# Altium project OpenPLCv0.2.0.PrjPcb (part 1 of 3)
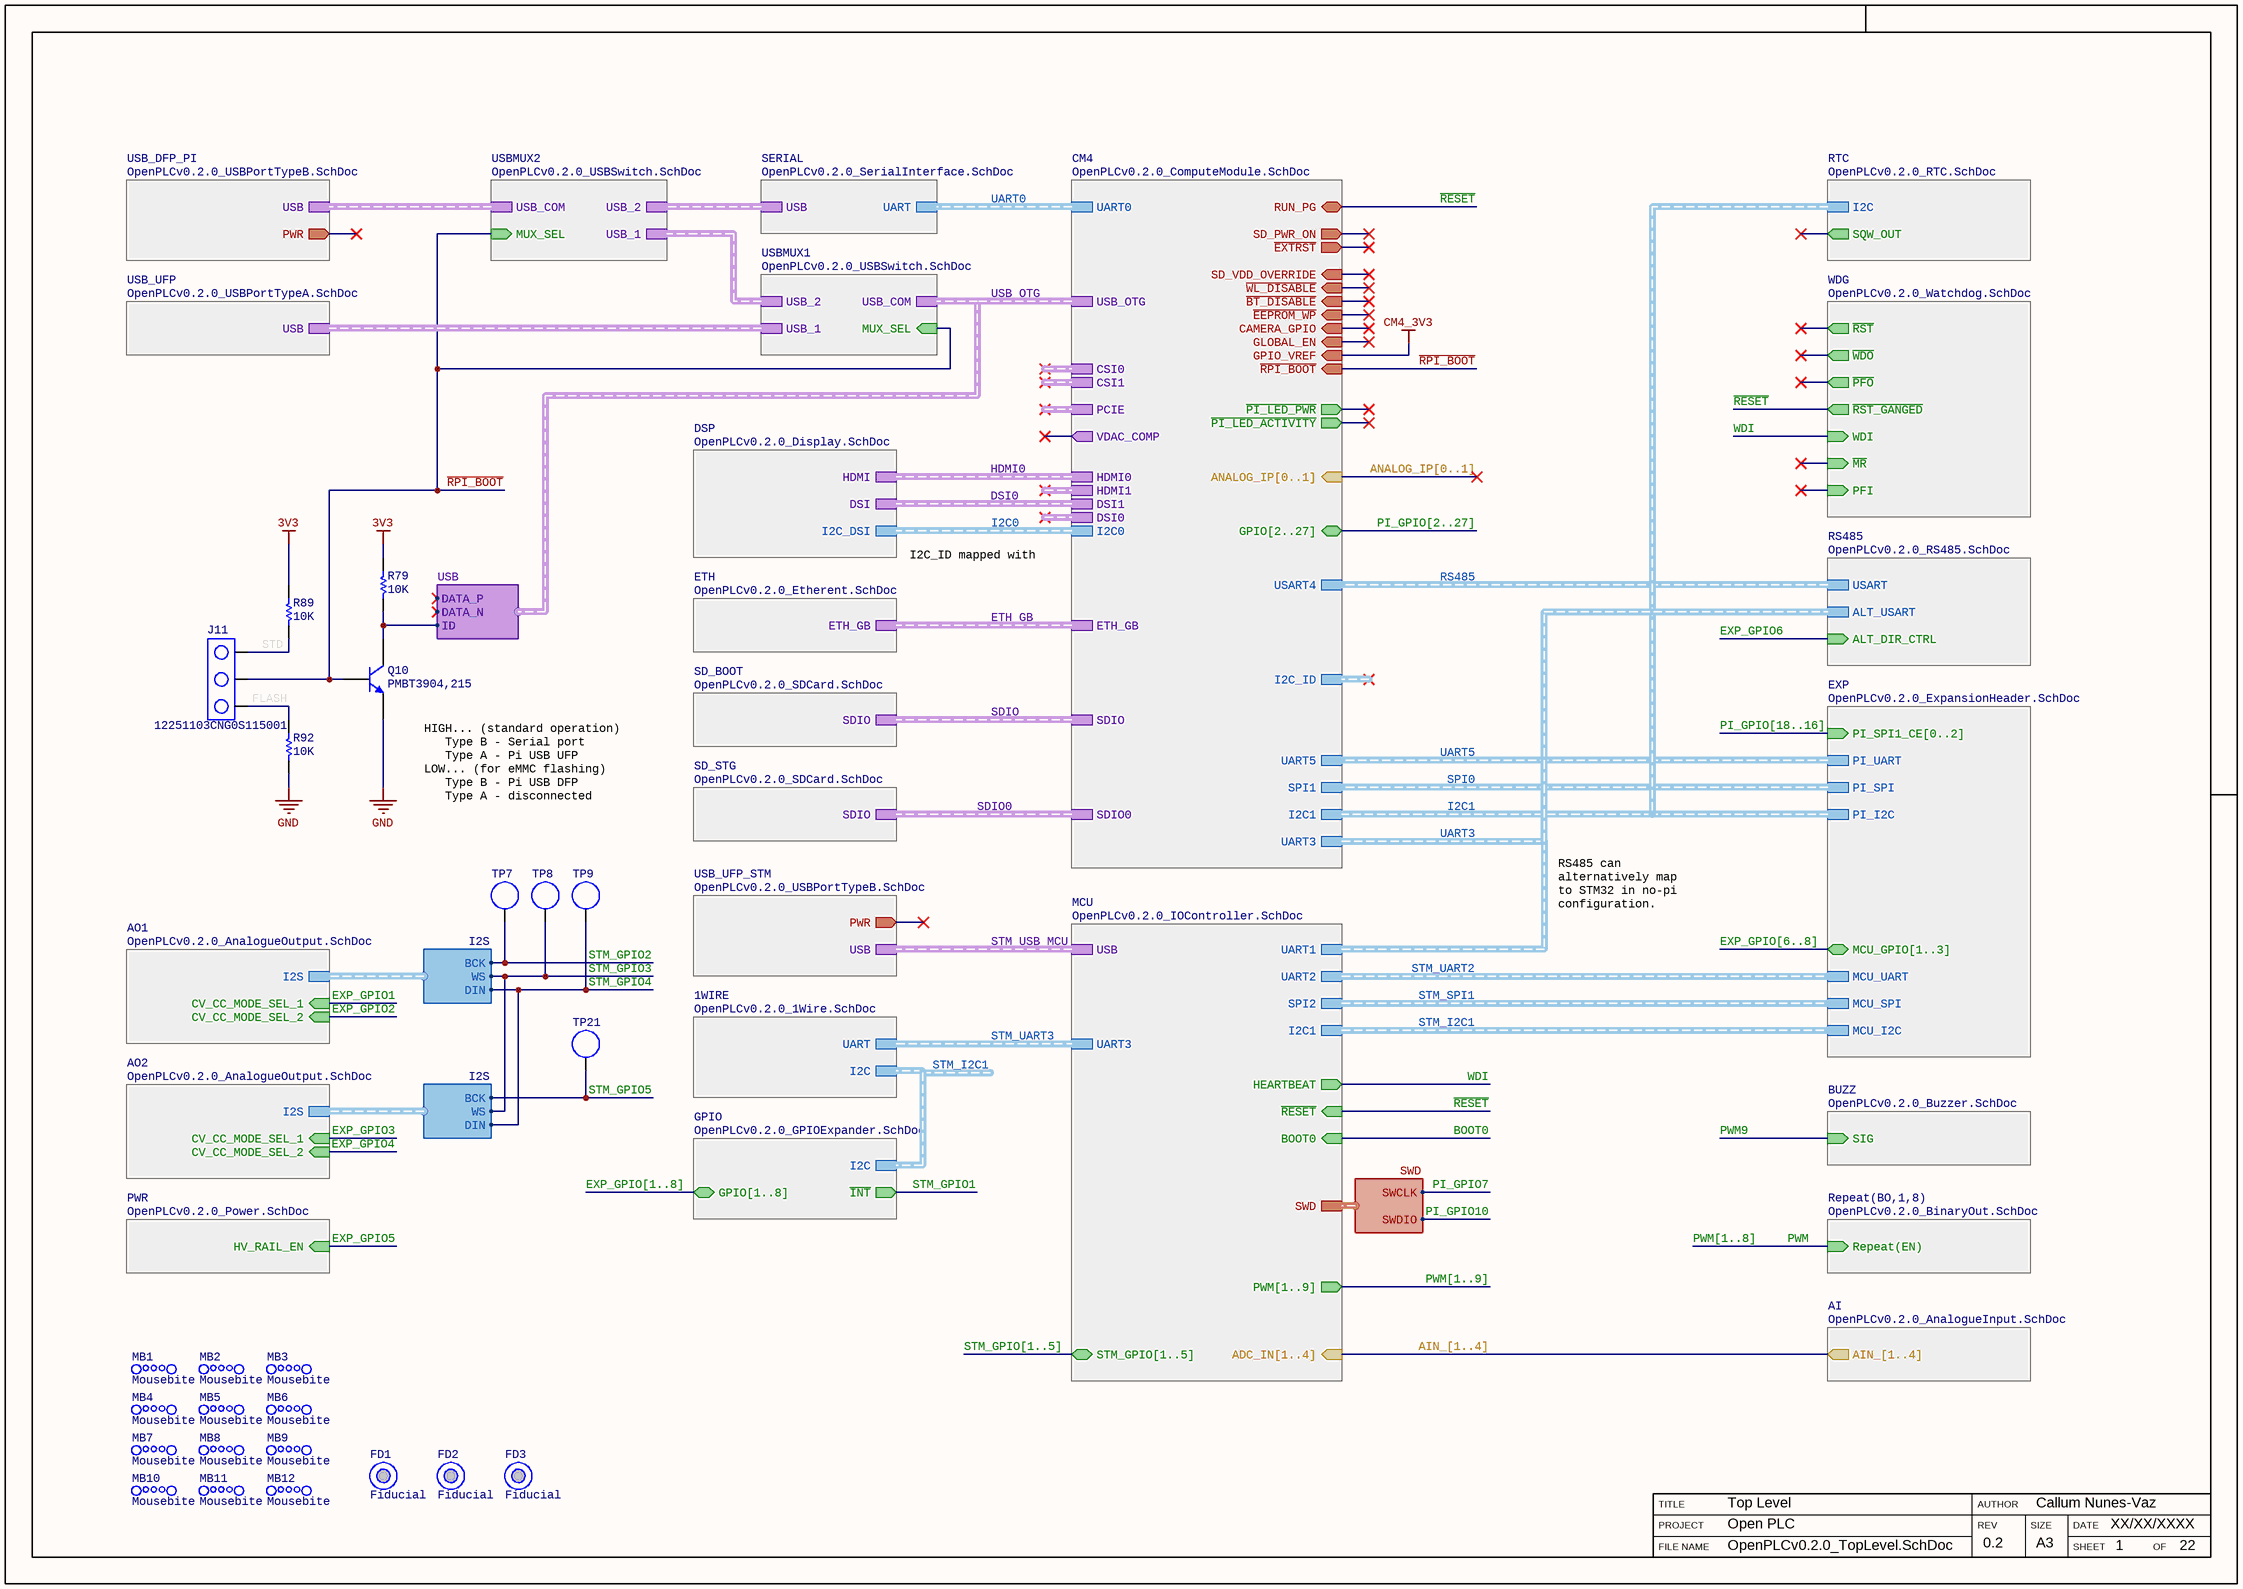
[diagram p0: OpenPLCv0.2.0_TopLevel.SchDoc]
AuthorName: Callum Nunes-Vaz; ProjectDate: XX/XX/XXXX; ProjectRevision: 0.2; ProjectTitle: Open PLC
22 sheets, 541 parts. Net scope: hierarchical (ports join the sheet entries above them; power ports are global).
Board files: OpenPLCv0.2.0.PcbDoc, OpenPLCv0.2.0_PANEL.PcbDoc
Sheets:
  OpenPLCv0.2.0_TopLevel.SchDoc
    CM4 = OpenPLCv0.2.0_ComputeModule.SchDoc
    AO1 = OpenPLCv0.2.0_AnalogueOutput.SchDoc
      LED_AO1 = OpenPLCv0.2.0_IOLED.SchDoc
      LED_AO2 = OpenPLCv0.2.0_IOLED.SchDoc
    AO2 = OpenPLCv0.2.0_AnalogueOutput.SchDoc
      LED_AO1 = OpenPLCv0.2.0_IOLED.SchDoc
      LED_AO2 = OpenPLCv0.2.0_IOLED.SchDoc
    MCU = OpenPLCv0.2.0_IOController.SchDoc
    BO1 = OpenPLCv0.2.0_BinaryOut.SchDoc
    BO2 = OpenPLCv0.2.0_BinaryOut.SchDoc
    BO3 = OpenPLCv0.2.0_BinaryOut.SchDoc
    BO4 = OpenPLCv0.2.0_BinaryOut.SchDoc
    BO5 = OpenPLCv0.2.0_BinaryOut.SchDoc
    BO6 = OpenPLCv0.2.0_BinaryOut.SchDoc
    BO7 = OpenPLCv0.2.0_BinaryOut.SchDoc
    BO8 = OpenPLCv0.2.0_BinaryOut.SchDoc
    BUZZ = OpenPLCv0.2.0_Buzzer.SchDoc
    EXP = OpenPLCv0.2.0_ExpansionHeader.SchDoc
    WDG = OpenPLCv0.2.0_Watchdog.SchDoc
    AI = OpenPLCv0.2.0_AnalogueInput.SchDoc
      LED_AI1 = OpenPLCv0.2.0_IOLED.SchDoc
      LED_AI2 = OpenPLCv0.2.0_IOLED.SchDoc
      LED_AI3 = OpenPLCv0.2.0_IOLED.SchDoc
      LED_AI4 = OpenPLCv0.2.0_IOLED.SchDoc
    PWR = OpenPLCv0.2.0_Power.SchDoc
    USB_UFP_STM = OpenPLCv0.2.0_USBPortTypeB.SchDoc
    1WIRE = OpenPLCv0.2.0_1Wire.SchDoc
    GPIO = OpenPLCv0.2.0_GPIOExpander.SchDoc
    RS485 = OpenPLCv0.2.0_RS485.SchDoc
    RTC = OpenPLCv0.2.0_RTC.SchDoc
    SD_STG = OpenPLCv0.2.0_SDCard.SchDoc
    DSP = OpenPLCv0.2.0_Display.SchDoc
    ETH = OpenPLCv0.2.0_Etherent.SchDoc
    SD_BOOT = OpenPLCv0.2.0_SDCard.SchDoc
    USB_UFP = OpenPLCv0.2.0_USBPortTypeA.SchDoc
    SERIAL = OpenPLCv0.2.0_SerialInterface.SchDoc
    USBMUX1 = OpenPLCv0.2.0_USBSwitch.SchDoc
    USB_DFP_PI = OpenPLCv0.2.0_USBPortTypeB.SchDoc
    USBMUX2 = OpenPLCv0.2.0_USBSwitch.SchDoc

## Sheet OpenPLCv0.2.0_TopLevel.SchDoc
size 420 x 297 mm; PageSetup: Record=PageOptions|CenterHorizontal=True|CenterVertical=True|PrintScale=1.01|XCorrection=1.00|YCorrection=1.00|PrintKind=1|BorderSize=5000000|LeftOffset=0|BottomOffset=0|Orientation=2|PaperLength=1000|PaperWidth=1000|Scale=100|PaperSource=7|PrintQuality=-4|MediaType=1|DitherType=10|PaperKind=A3|PrintScaleMode=1; Author: Callum Nunes-Vaz; DocumentNumber: 1; SheetNumber: 1; SheetTotal: 22; SheetTitle: Top Level

### Parts
FD1  Fiducial  [Fiducial]
FD2  Fiducial  [Fiducial]
FD3  Fiducial  [Fiducial]
J11  12251103CNG0S115001  [Header_3POS]
MB1  Mousebite  [MOUSEBITE]  (no BOM)
MB2  Mousebite  [MOUSEBITE]  (no BOM)
MB3  Mousebite  [MOUSEBITE]  (no BOM)
MB4  Mousebite  [MOUSEBITE]  (no BOM)
MB5  Mousebite  [MOUSEBITE]  (no BOM)
MB6  Mousebite  [MOUSEBITE]  (no BOM)
MB7  Mousebite  [MOUSEBITE]  (no BOM)
MB8  Mousebite  [MOUSEBITE]  (no BOM)
MB9  Mousebite  [MOUSEBITE]  (no BOM)
MB10  Mousebite  [MOUSEBITE]  (no BOM)
MB11  Mousebite  [MOUSEBITE]  (no BOM)
MB12  Mousebite  [MOUSEBITE]  (no BOM)
Q10  PMBT3904,215  [SOT23-3]
R79  Resistance: 10K  [SMD_RES_0402(1005)_N]  (hidden comment: RC0402FR-0710KL)
R89  Resistance: 10K  [SMD_RES_0402(1005)_N]  (hidden comment: RC0402FR-0710KL)
R92  Resistance: 10K  [SMD_RES_0402(1005)_N]  (hidden comment: RC0402FR-0710KL)
TP7  TestPoint  [Pad]  (value not drawn)  (no BOM)
TP8  TestPoint  [Pad]  (value not drawn)  (no BOM)
TP9  TestPoint  [Pad]  (value not drawn)  (no BOM)
TP21  TestPoint  [Pad]  (value not drawn)  (no BOM)

### Sub-sheets
1WIRE = OpenPLCv0.2.0_1Wire.SchDoc: I2C (harness I2C), UART (harness UART)
AI = OpenPLCv0.2.0_AnalogueInput.SchDoc: AIN_[1..4] (out)
AO1 = OpenPLCv0.2.0_AnalogueOutput.SchDoc: CV_CC_MODE_SEL_1 (in), I2S (harness I2S), CV_CC_MODE_SEL_2 (in)
AO2 = OpenPLCv0.2.0_AnalogueOutput.SchDoc: CV_CC_MODE_SEL_1 (in), I2S (harness I2S), CV_CC_MODE_SEL_2 (in)
BUZZ = OpenPLCv0.2.0_Buzzer.SchDoc: SIG (in)
CM4 = OpenPLCv0.2.0_ComputeModule.SchDoc: USB_OTG (harness USB), I2C1 (harness I2C), VDAC_COMP (out), PCIE (harness PCIE), CSI1 (harness MIPI_CSI_4L), CSI0 (harness MIPI_CSI_2L), HDMI0 (harness HDMI), SDIO (harness SDIO_X8), HDMI1 (harness HDMI), ETH_GB (harness ETH_GP), I2C_ID (harness I2C), UART0 (harness UART), UART3 (harness UART), I2C0 (harness I2C), SDIO0 (harness SDIO_X8), UART5 (harness UART), SPI1 (harness SPI), USART4 (harness USART), DSI1 (harness MIPI_DSI_4L), DSI0 (harness MIPI_DSI_2L), RUN_PG (bidir), SD_PWR_ON (out), ~{EXTRST} (out), GLOBAL_EN (in), ~{RPI_BOOT} (in), CAMERA_GPIO (in), ~{WL_DISABLE} (in), ~{EEPROM_WP} (in), ~{BT_DISABLE} (in), SD_VDD_OVERRIDE (in), GPIO_VREF (in), ~{PI_LED_PWR} (out), ~{PI_LED_ACTIVITY} (out), ANALOG_IP[0..1] (in), GPIO[2..27] (bidir)
DSP = OpenPLCv0.2.0_Display.SchDoc: I2C_DSI (harness I2C), HDMI (harness HDMI), DSI (harness MIPI_DSI_4L)
ETH = OpenPLCv0.2.0_Etherent.SchDoc: ETH_GB (harness ETH_GP)
EXP = OpenPLCv0.2.0_ExpansionHeader.SchDoc: MCU_I2C (harness I2C), MCU_UART (harness UART), MCU_SPI (harness SPI), PI_SPI1_CE[0..2] (in), PI_I2C (harness I2C), PI_UART (harness UART), PI_SPI (harness SPI), MCU_GPIO[1..3] (bidir)
GPIO = OpenPLCv0.2.0_GPIOExpander.SchDoc: I2C (harness I2C), GPIO[1..8] (bidir), ~{INT} (out)
MCU = OpenPLCv0.2.0_IOController.SchDoc: ADC_IN[1..4] (in), STM_GPIO[1..5] (bidir), UART1 (harness UART), UART2 (harness UART), SPI2 (harness SPI), SWD (harness SWD), PWM[1..9] (out), BOOT0 (in), USB (harness USB), UART3 (harness UART), I2C1 (harness I2C), ~{RESET} (in), HEARTBEAT (out)
PWR = OpenPLCv0.2.0_Power.SchDoc: HV_RAIL_EN (in)
Repeat(BO,1,8) = OpenPLCv0.2.0_BinaryOut.SchDoc: Repeat(EN) (in)
RS485 = OpenPLCv0.2.0_RS485.SchDoc: USART (harness USART), ALT_USART (harness USART), ALT_DIR_CTRL (in)
RTC = OpenPLCv0.2.0_RTC.SchDoc: SQW_OUT (out), I2C (harness I2C)
SD_BOOT = OpenPLCv0.2.0_SDCard.SchDoc: SDIO (harness SDIO_X8)
SD_STG = OpenPLCv0.2.0_SDCard.SchDoc: SDIO (harness SDIO_X8)
SERIAL = OpenPLCv0.2.0_SerialInterface.SchDoc: UART (harness UART), USB (harness USB)
USB_DFP_PI = OpenPLCv0.2.0_USBPortTypeB.SchDoc: USB (harness USB), PWR (out)
USB_UFP = OpenPLCv0.2.0_USBPortTypeA.SchDoc: USB (harness USB)
USB_UFP_STM = OpenPLCv0.2.0_USBPortTypeB.SchDoc: USB (harness USB), PWR (out)
USBMUX1 = OpenPLCv0.2.0_USBSwitch.SchDoc: USB_COM (harness USB), USB_1 (harness USB), USB_2 (harness USB), MUX_SEL (in)
USBMUX2 = OpenPLCv0.2.0_USBSwitch.SchDoc: USB_COM (harness USB), USB_1 (harness USB), USB_2 (harness USB), MUX_SEL (in)
WDG = OpenPLCv0.2.0_Watchdog.SchDoc: PFI (in), ~{MR} (in), WDI (in), ~{PFO} (out), ~{WDO} (out), ~{RST} (out), ~{RST_GANGED} (out)

### Harnesses
SWD: SWCLK, SWDIO
I2S: WS, BCK, DIN
USB: DATA_P, DATA_N, ID

### Nets
3V3: R79.1 R89.2
GND: Q10.2(E) R92.1
FLASH: J11.3 R92.2
PWM: sheet Repeat(BO,1,8)/Repeat(EN)
~{RESET}: sheet CM4/RUN_PG, sheet MCU/~{RESET}, sheet WDG/~{RST_GANGED}
~{RPI_BOOT}: J11.2 Q10.1(B) ; sheet CM4/~{RPI_BOOT}, sheet USBMUX1/MUX_SEL, sheet USBMUX2/MUX_SEL  [project net MUX_SEL]
STD: J11.1 R89.1
STM_GPIO2: TP7.1 ; sheet AO1/I2S.BCK  [project net I2S_DAC_BCK]
STM_GPIO3: TP8.1 ; sheet AO2/I2S.WS, sheet AO1/I2S.WS  [project net I2S_DAC_WS]
STM_GPIO4: TP9.1 ; sheet AO2/I2S.DIN, sheet AO1/I2S.DIN  [project net I2S_DAC_DIN]
STM_GPIO5: TP21.1 ; sheet AO2/I2S.BCK  [project net I2S_DAC_BCK]
USB_OTG.ID: Q10.3(C) R79.2 ; sheet CM4/USB_OTG.ID
WDI: sheet MCU/HEARTBEAT, sheet WDG/WDI  [project net LED]

### Buses and harness runs
bus AIN_[1..4] = sheet AI/AIN_[1..4] = sheet MCU/ADC_IN[1..4]
bus ANALOG_IP[0..1] = sheet CM4/ANALOG_IP[0..1]
bus EXP_GPIO[1..8] = sheet GPIO/GPIO[1..8]
bus EXP_GPIO[6..8] = sheet EXP/MCU_GPIO[1..3]
bus PI_GPIO[2..27] = sheet CM4/GPIO[2..27]
bus PI_GPIO[18..16] = sheet EXP/PI_SPI1_CE[0..2]
bus PWM[1..8]
bus PWM[1..9] = sheet MCU/PWM[1..9]
bus STM_GPIO[1..5] = sheet MCU/STM_GPIO[1..5]
harness DSI0 = sheet CM4/DSI1 = sheet DSP/DSI
harness ETH_GB = sheet CM4/ETH_GB = sheet ETH/ETH_GB
harness HDMI0 = sheet CM4/HDMI0 = sheet DSP/HDMI
harness I2C0 = sheet CM4/I2C0 = sheet DSP/I2C_DSI
harness I2C1 = sheet CM4/I2C1 = sheet EXP/PI_I2C = sheet RTC/I2C
harness RS485 = sheet CM4/USART4 = sheet RS485/USART
harness SDIO0 = sheet CM4/SDIO0 = sheet SD_STG/SDIO
harness SDIO = sheet CM4/SDIO = sheet SD_BOOT/SDIO
harness sheet SERIAL/USB = sheet USBMUX2/USB_2
harness sheet USB_DFP_PI/USB = sheet USBMUX2/USB_COM
harness sheet USB_UFP/USB = sheet USBMUX1/USB_1
harness sheet USBMUX1/USB_2 = sheet USBMUX2/USB_1
harness SPI0 = sheet CM4/SPI1 = sheet EXP/PI_SPI
harness STM_I2C1 = sheet 1WIRE/I2C = sheet GPIO/I2C
harness STM_I2C1 = sheet EXP/MCU_I2C = sheet MCU/I2C1
harness STM_SPI1 = sheet EXP/MCU_SPI = sheet MCU/SPI2
harness STM_UART2 = sheet EXP/MCU_UART = sheet MCU/UART2
harness STM_UART3 = sheet 1WIRE/UART = sheet MCU/UART3
harness STM_USB_MCU = sheet MCU/USB = sheet USB_UFP_STM/USB
harness UART0 = sheet CM4/UART0 = sheet SERIAL/UART
harness UART3 = sheet CM4/UART3 = sheet MCU/UART1 = sheet RS485/ALT_USART
harness UART5 = sheet CM4/UART5 = sheet EXP/PI_UART
harness USB_OTG = sheet CM4/USB_OTG = sheet USBMUX1/USB_COM

### Notes on the sheet
- I2C_ID mapped with DSI1
- (near Q10) HIGH... (standard operation)
  Type B - Serial port
  Type A - Pi USB UFP
  LOW... (for eMMC flashing)
  Type B - Pi USB DFP
  Type A - disconnected
- RS485 can alternatively map to STM32 in no-pi configuration.
- FILE NAME
- PROJECT
- TITLE
- REV
- AUTHOR
- SIZE
- SHEET
- DATE
- OF
- A3

### Library data of the parts
J11 = 3-way Jumper: Pin Header 3 1 right-angle，180degrees 2.54mm Through Hole,P=2.54mm Pin Header & Female Header RoHS
Q10 = PMBT3904,215: NPN 200mA 40V 250mW SOT-23(SOT-23-3) Transistors (NPN/PNP) RoHS
R79 R89 R92 = 10K 0402 1% 1/16W: 10kΩ ±1% 1/16W ±100ppm/℃ 0402 Chip Resistor - Surface Mount RoHS; Package: 0402; Tolerance: 1%; Power Rating: 1/16W
TP7-TP9 TP21 = Test point

## Sheet OpenPLCv0.2.0_ComputeModule.SchDoc
size 420 x 297 mm; PageSetup: Record=PageOptions|CenterHorizontal=True|CenterVertical=True|PrintScale=1.01|XCorrection=1.00|YCorrection=1.00|PrintKind=1|BorderSize=5000000|LeftOffset=0|BottomOffset=0|Orientation=2|PaperLength=1000|PaperWidth=1000|Scale=100|PaperSource=7|PrintQuality=-4|MediaType=1|DitherType=10|PaperKind=A3|PrintScaleMode=1; DocumentNumber: 2; SheetNumber: 2; SheetTotal: 22; SheetTitle: Compute Module 4
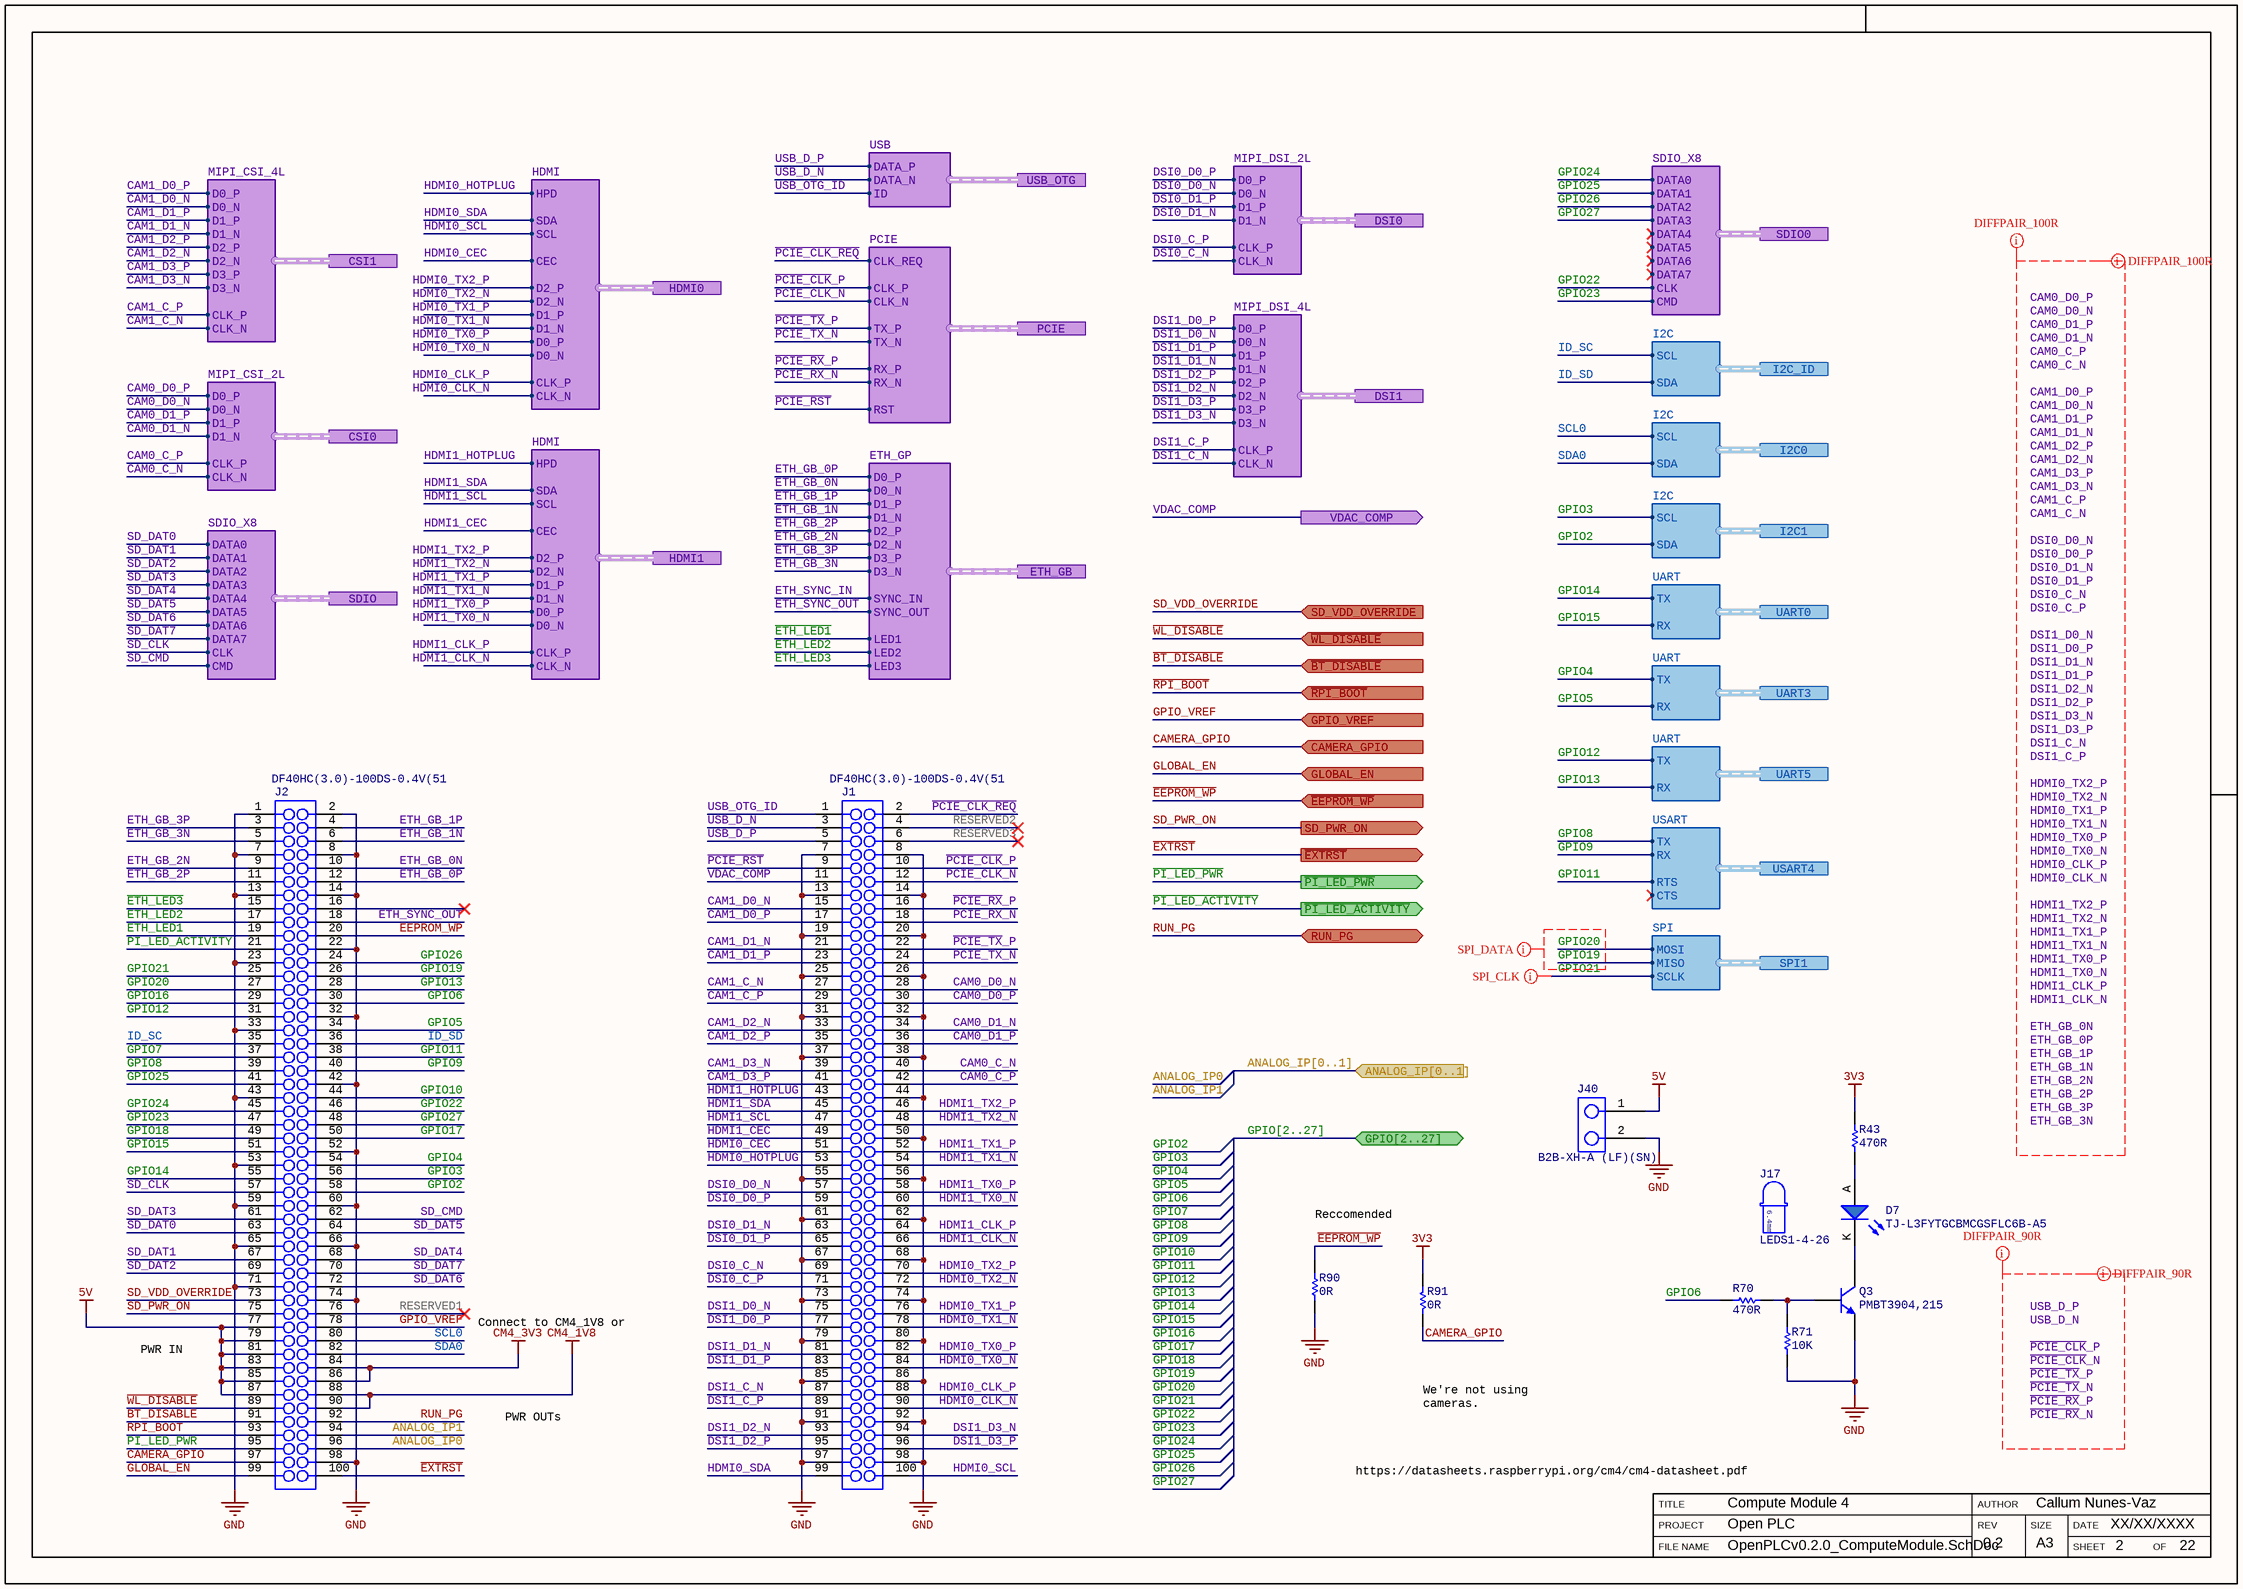
[diagram p1: OpenPLCv0.2.0_ComputeModule.SchDoc]

### Parts
D7  TJ-L3FYTGCBMCGSFLC6B-A5  [LED_3MM_SPACED_6.4MM_BLUE]
J1  DF40HC(3.0)-100DS-0.4V(51  [DF40HC(3.0)-100DS-0.4V(51]
J2  DF40HC(3.0)-100DS-0.4V(51  [DF40HC(3.0)-100DS-0.4V(51]
J17  LEDS1-4-26  [3MM_LED_SPACER_6.4MM]
J40  B2B-XH-A (LF)(SN)  [B2B-XH-A (LF)(SN)]
Q3  PMBT3904,215  [SOT23-3]
R43  Resistance: 470R  [SMD_RES_0402(1005)_N]  (hidden comment: RC0402FR-07470RL)
R70  Resistance: 470R  [SMD_RES_0402(1005)_N]  (hidden comment: RC0402FR-07470RL)
R71  Resistance: 10K  [SMD_RES_0402(1005)_N]  (hidden comment: RC0402FR-0710KL)
R90  Resistance: 0R  [SMD_RES_0402(1005)_N]  (hidden comment: RC0402FR-070RL)
R91  Resistance: 0R  [SMD_RES_0402(1005)_N]  (hidden comment: RC0402FR-070RL)

### Ports
ANALOG_IP[0..1] (in), CAMERA_GPIO (in), CSI0 (harness MIPI_CSI_2L), CSI1 (harness MIPI_CSI_4L), DSI0 (harness MIPI_DSI_2L), DSI1 (harness MIPI_DSI_4L), ETH_GB (harness ETH_GP), GLOBAL_EN (in), GPIO[2..27] (bidir), GPIO_VREF (in), HDMI0 (harness HDMI), HDMI1 (harness HDMI), I2C0 (harness I2C), I2C1 (harness I2C), I2C_ID (harness I2C), PCIE (harness PCIE), RUN_PG (bidir), SD_PWR_ON (out), SD_VDD_OVERRIDE (in), SDIO0 (harness SDIO_X8), SDIO (harness SDIO_X8), SPI1 (harness SPI), UART0 (harness UART), UART3 (harness UART), UART5 (harness UART), USART4 (harness USART), USB_OTG (harness USB), VDAC_COMP (out), ~{BT_DISABLE} (in), ~{EEPROM_WP} (in), ~{EXTRST} (out), ~{PI_LED_ACTIVITY} (out), ~{PI_LED_PWR} (out), ~{RPI_BOOT} (in), ~{WL_DISABLE} (in)

### Harnesses
USB: DATA_P, DATA_N, ID
MIPI_CSI_4L: D1_N, D1_P, D0_P, D0_N, CLK_P, CLK_N, D2_N, D2_P, D3_N, D3_P
MIPI_CSI_2L: D1_N, D1_P, D0_P, D0_N, CLK_P, CLK_N
SDIO_X8: DATA1, DATA0, DATA2, DATA3, DATA4, DATA5, DATA6, CMD, CLK, DATA7
HDMI: CLK_P, CLK_N, D0_P, D0_N, D2_N, D2_P, D1_N, D1_P, CEC, HPD, SDA, SCL
PCIE: CLK_P, CLK_N, TX_P, TX_N, RX_P, RX_N, CLK_REQ, RST
ETH_GP: D0_P, D0_N, D1_P, D1_N, D2_P, D2_N, D3_P, D3_N, SYNC_IN, SYNC_OUT, LED1, LED2, LED3
MIPI_DSI_4L: D1_N, D1_P, D0_P, D0_N, CLK_P, CLK_N, D2_N, D2_P, D3_N, D3_P
MIPI_DSI_2L: D1_N, D1_P, D0_P, D0_N, CLK_P, CLK_N
I2C: SCL, SDA
UART: TX, RX
SPI: MOSI, MISO, SCLK
USART: TX, RX, RTS, CTS

### Nets
3V3: R43.1 R91.1
5V: J2.77 J2.79 J2.81 J2.83 J2.85 J2.87 J40.1
CM4_1V8: J2.88 J2.90
GND: J1.7 J1.8 J1.13 J1.14 J1.19 J1.20 J1.25 J1.26 J1.31 J1.32 J1.37 J1.38 J1.44 J1.50 J1.55 J1.56 J1.61 J1.62 J1.67 J1.68 J1.73 J1.74 J1.79 J1.80 J1.85 J1.86 J1.91 J1.92 J1.97 J1.98 J2.1 J2.2 J2.7 J2.8 J2.13 J2.14 J2.22 J2.23 J2.32 J2.33 J2.42 J2.43 J2.52 J2.53 J2.59 J2.60 J2.65 J2.66 J2.71 J2.74 J2.98 J40.2 Q3.2(E) R71.1 R90.1
GPIO_VREF: J2.78 J2.84 J2.86 ; port GPIO_VREF  [also labelled CM4_3V3]
ANALOG_IP0: J2.96
ANALOG_IP1: J2.94
~{BT_DISABLE}: J2.91 ; port ~{BT_DISABLE}
CAM0_C_N: J1.40 ; port CSI0.CLK_N
CAM0_C_P: J1.42 ; port CSI0.CLK_P
CAM0_D0_N: J1.28 ; port CSI0.D0_N
CAM0_D0_P: J1.30 ; port CSI0.D0_P
CAM0_D1_N: J1.34 ; port CSI0.D1_N
CAM0_D1_P: J1.36 ; port CSI0.D1_P
CAM1_C_N: J1.27 ; port CSI1.CLK_N
CAM1_C_P: J1.29 ; port CSI1.CLK_P
CAM1_D0_N: J1.15 ; port CSI1.D0_N
CAM1_D0_P: J1.17 ; port CSI1.D0_P
CAM1_D1_N: J1.21 ; port CSI1.D1_N
CAM1_D1_P: J1.23 ; port CSI1.D1_P
CAM1_D2_N: J1.33 ; port CSI1.D2_N
CAM1_D2_P: J1.35 ; port CSI1.D2_P
CAM1_D3_N: J1.39 ; port CSI1.D3_N
CAM1_D3_P: J1.41 ; port CSI1.D3_P
CAMERA_GPIO: J2.97 R91.2 ; port CAMERA_GPIO
DSI0_C_N: J1.69 ; port DSI0.CLK_N
DSI0_C_P: J1.71 ; port DSI0.CLK_P
DSI0_D0_N: J1.57 ; port DSI0.D0_N
DSI0_D0_P: J1.59 ; port DSI0.D0_P
DSI0_D1_N: J1.63 ; port DSI0.D1_N
DSI0_D1_P: J1.65 ; port DSI0.D1_P
DSI1_C_N: J1.87 ; port DSI1.CLK_N  [project net DSI0.CLK_N]
DSI1_C_P: J1.89 ; port DSI1.CLK_P  [project net DSI0.CLK_P]
DSI1_D0_N: J1.75 ; port DSI1.D0_N  [project net DSI0.D0_N]
DSI1_D0_P: J1.77 ; port DSI1.D0_P  [project net DSI0.D0_P]
DSI1_D1_N: J1.81 ; port DSI1.D1_N  [project net DSI0.D1_N]
DSI1_D1_P: J1.83 ; port DSI1.D1_P  [project net DSI0.D1_P]
DSI1_D2_N: J1.93 ; port DSI1.D2_N  [project net DSI0.D2_N]
DSI1_D2_P: J1.95 ; port DSI1.D2_P  [project net DSI0.D2_P]
DSI1_D3_N: J1.94 ; port DSI1.D3_N  [project net DSI0.D3_N]
DSI1_D3_P: J1.96 ; port DSI1.D3_P  [project net DSI0.D3_P]
~{EEPROM_WP}: J2.20 R90.2 ; port ~{EEPROM_WP}
~{ETH_LED1}: J2.19 ; port ETH_GB.LED1
~{ETH_LED2}: J2.17 ; port ETH_GB.LED2
~{ETH_LED3}: J2.15 ; port ETH_GB.LED3
~{EXTRST}: J2.100 ; port ~{EXTRST}
ETH_GB_0N: J2.10 ; port ETH_GB.D0_N  [project net ETH_GB.D0_N]
ETH_GB_0P: J2.12 ; port ETH_GB.D0_P  [project net ETH_GB.D0_P]
ETH_GB_1N: J2.6 ; port ETH_GB.D1_N  [project net ETH_GB.D1_N]
ETH_GB_1P: J2.4 ; port ETH_GB.D1_P  [project net ETH_GB.D1_P]
ETH_GB_2N: J2.9 ; port ETH_GB.D2_N  [project net ETH_GB.D2_N]
ETH_GB_2P: J2.11 ; port ETH_GB.D2_P  [project net ETH_GB.D2_P]
ETH_GB_3N: J2.5 ; port ETH_GB.D3_N  [project net ETH_GB.D3_N]
ETH_GB_3P: J2.3 ; port ETH_GB.D3_P  [project net ETH_GB.D3_P]
ETH_SYNC_IN: port ETH_GB.SYNC_IN  [project net ETH_GB.SYNC_IN]
ETH_SYNC_OUT: J2.18 ; port ETH_GB.SYNC_OUT  [project net ETH_GB.SYNC_OUT]
GLOBAL_EN: J2.99 ; port GLOBAL_EN
GPIO2: J2.58 ; port I2C1.SDA
GPIO3: J2.56 ; port I2C1.SCL
GPIO4: J2.54 ; port UART3.TX
GPIO5: J2.34 ; port UART3.RX
GPIO6: J2.30 R70.2
GPIO7: J2.37
GPIO8: J2.39 ; port USART4.TX
GPIO9: J2.40 ; port USART4.RX
GPIO10: J2.44
GPIO11: J2.38 ; port USART4.RTS  [project net DIR]
GPIO12: J2.31 ; port UART5.TX
GPIO13: J2.28 ; port UART5.RX
GPIO14: J2.55 ; port UART0.TX
GPIO15: J2.51 ; port UART0.RX
GPIO16: J2.29
GPIO17: J2.50
GPIO18: J2.49
GPIO19: J2.26 ; port SPI1.MISO
GPIO20: J2.27 ; port SPI1.MOSI
GPIO21: J2.25 ; port SPI1.SCLK
GPIO22: J2.46 ; port SDIO0.CLK
GPIO23: J2.47 ; port SDIO0.CMD
GPIO24: J2.45 ; port SDIO0.DATA0
GPIO25: J2.41 ; port SDIO0.DATA1
GPIO26: J2.24 ; port SDIO0.DATA2
GPIO27: J2.48 ; port SDIO0.DATA3
HDMI0_CEC: J1.51 ; port HDMI0.CEC  [project net HDMI.CEC]
HDMI0_CLK_N: J1.90 ; port HDMI0.CLK_N  [project net HDMI.CLK_N]
HDMI0_CLK_P: J1.88 ; port HDMI0.CLK_P  [project net HDMI.CLK_P]
HDMI0_HOTPLUG: J1.53 ; port HDMI0.HPD  [project net HDMI.HPD]
HDMI0_SCL: J1.100 ; port HDMI0.SCL  [project net HDMI.SCL]
HDMI0_SDA: J1.99 ; port HDMI0.SDA  [project net HDMI.SDA]
HDMI0_TX0_N: J1.84 ; port HDMI0.D0_N  [project net HDMI.D0_N]
HDMI0_TX0_P: J1.82 ; port HDMI0.D0_P  [project net HDMI.D0_P]
HDMI0_TX1_N: J1.78 ; port HDMI0.D1_N  [project net HDMI.D1_N]
HDMI0_TX1_P: J1.76 ; port HDMI0.D1_P  [project net HDMI.D1_P]
HDMI0_TX2_N: J1.72 ; port HDMI0.D2_N  [project net HDMI.D2_N]
HDMI0_TX2_P: J1.70 ; port HDMI0.D2_P  [project net HDMI.D2_P]
HDMI1_CEC: J1.49 ; port HDMI1.CEC
HDMI1_CLK_N: J1.66 ; port HDMI1.CLK_N
HDMI1_CLK_P: J1.64 ; port HDMI1.CLK_P
HDMI1_HOTPLUG: J1.43 ; port HDMI1.HPD
HDMI1_SCL: J1.47 ; port HDMI1.SCL
HDMI1_SDA: J1.45 ; port HDMI1.SDA
HDMI1_TX0_N: J1.60 ; port HDMI1.D0_N
HDMI1_TX0_P: J1.58 ; port HDMI1.D0_P
HDMI1_TX1_N: J1.54 ; port HDMI1.D1_N
HDMI1_TX1_P: J1.52 ; port HDMI1.D1_P
HDMI1_TX2_N: J1.48 ; port HDMI1.D2_N
HDMI1_TX2_P: J1.46 ; port HDMI1.D2_P
ID_SC: J2.35 ; port I2C_ID.SCL
ID_SD: J2.36 ; port I2C_ID.SDA
~{PCIE_CLK_REQ}: J1.2 ; port PCIE.CLK_REQ
~{PCIE_CLK}_N: J1.12 ; port PCIE.CLK_N
~{PCIE_CLK}_P: J1.10 ; port PCIE.CLK_P
~{PCIE_RST}: J1.9 ; port PCIE.RST
~{PCIE_RX}_N: J1.18 ; port PCIE.RX_N
~{PCIE_RX}_P: J1.16 ; port PCIE.RX_P
~{PCIE_TX}_N: J1.24 ; port PCIE.TX_N
~{PCIE_TX}_P: J1.22 ; port PCIE.TX_P
~{PI_LED_ACTIVITY}: J2.21 ; port ~{PI_LED_ACTIVITY}
~{PI_LED_PWR}: J2.95 ; port ~{PI_LED_PWR}
~{RPI_BOOT}: J2.93 ; port ~{RPI_BOOT}  [project net MUX_SEL]
RESERVED1: J2.76
RESERVED2: J1.4
RESERVED3: J1.6
RUN_PG: J2.92 ; port RUN_PG  [project net ~{RESET}]
SCL0: J2.80 ; port I2C0.SCL  [project net I2C0.SCL]
SD_CLK: J2.57 ; port SDIO.CLK
SD_CMD: J2.62 ; port SDIO.CMD
SD_DAT0: J2.63 ; port SDIO.DATA0
SD_DAT1: J2.67 ; port SDIO.DATA1
SD_DAT2: J2.69 ; port SDIO.DATA2
SD_DAT3: J2.61 ; port SDIO.DATA3
SD_DAT4: J2.68 ; port SDIO.DATA4
SD_DAT5: J2.64 ; port SDIO.DATA5
SD_DAT6: J2.72 ; port SDIO.DATA6
SD_DAT7: J2.70 ; port SDIO.DATA7
SD_PWR_ON: J2.75 ; port SD_PWR_ON
SD_VDD_OVERRIDE: J2.73 ; port SD_VDD_OVERRIDE
SDA0: J2.82 ; port I2C0.SDA  [project net I2C0.SDA]
USB_D_N: J1.3 ; port USB_OTG.DATA_N  [project net USB_COM_D_N]
USB_D_P: J1.5 ; port USB_OTG.DATA_P  [project net USB_COM_D_P]
USB_OTG_ID: J1.1 ; port USB_OTG.ID  [project net USB_OTG.ID]
VDAC_COMP: J1.11 ; port VDAC_COMP
~{WL_DISABLE}: J2.89 ; port ~{WL_DISABLE}
NetD7_A: D7.A R43.2
NetD7_K: D7.K Q3.3(C)
NetQ3_1: Q3.1(B) R70.1 R71.2

Not connected (* = marked no-connect by the designer): J2 16*

### Buses and harness runs
bus ANALOG_IP[0..1] = port ANALOG_IP[0..1]
bus GPIO[2..27] = port GPIO[2..27]

### Layout directives
differential pair; differential pair class 90R_DIFF_PAIRS; net class 90R_PAIRS: USB_D_N, USB_D_P, ~{PCIE_CLK}_N, ~{PCIE_CLK}_P, ~{PCIE_RX}_N, ~{PCIE_RX}_P, ~{PCIE_TX}_N, ~{PCIE_TX}_P
differential pair; differential pair class 100R_DIFF_PAIRS; net class 100R_PAIRS: CAM0_C_N, CAM0_C_P, CAM0_D0_N, CAM0_D0_P, CAM0_D1_N, CAM0_D1_P, CAM1_C_N, CAM1_C_P, CAM1_D0_N, CAM1_D0_P, CAM1_D1_N, CAM1_D1_P, CAM1_D2_N, CAM1_D2_P, CAM1_D3_N, CAM1_D3_P, DSI0_C_N, DSI0_C_P, DSI0_D0_N, DSI0_D0_P, DSI0_D1_N, DSI0_D1_P, DSI1_C_N, DSI1_C_P, DSI1_D0_N, DSI1_D0_P, DSI1_D1_N, DSI1_D1_P, DSI1_D2_N, DSI1_D2_P, DSI1_D3_N, DSI1_D3_P, ETH_GB_0N, ETH_GB_0P, ETH_GB_1N, ETH_GB_1P, ETH_GB_2N, ETH_GB_2P, ETH_GB_3N, ETH_GB_3P, HDMI0_CLK_N, HDMI0_CLK_P, HDMI0_TX0_N, HDMI0_TX0_P, HDMI0_TX1_N, HDMI0_TX1_P, HDMI0_TX2_N, HDMI0_TX2_P, HDMI1_CLK_N, HDMI1_CLK_P, HDMI1_TX0_N, HDMI1_TX0_P, HDMI1_TX1_N, HDMI1_TX1_P, HDMI1_TX2_N, HDMI1_TX2_P
mark named DIFFPAIR_100R: CAM0_C_N, CAM0_C_P, CAM0_D0_N, CAM0_D0_P, CAM0_D1_N, CAM0_D1_P, CAM1_C_N, CAM1_C_P, CAM1_D0_N, CAM1_D0_P, CAM1_D1_N, CAM1_D1_P, CAM1_D2_N, CAM1_D2_P, CAM1_D3_N, CAM1_D3_P, DSI0_C_N, DSI0_C_P, DSI0_D0_N, DSI0_D0_P, DSI0_D1_N, DSI0_D1_P, DSI1_C_N, DSI1_C_P, DSI1_D0_N, DSI1_D0_P, DSI1_D1_N, DSI1_D1_P, DSI1_D2_N, DSI1_D2_P, DSI1_D3_N, DSI1_D3_P, ETH_GB_0N, ETH_GB_0P, ETH_GB_1N, ETH_GB_1P, ETH_GB_2N, ETH_GB_2P, ETH_GB_3N, ETH_GB_3P, HDMI0_CLK_N, HDMI0_CLK_P, HDMI0_TX0_N, HDMI0_TX0_P, HDMI0_TX1_N, HDMI0_TX1_P, HDMI0_TX2_N, HDMI0_TX2_P, HDMI1_CLK_N, HDMI1_CLK_P, HDMI1_TX0_N, HDMI1_TX0_P, HDMI1_TX1_N, HDMI1_TX1_P, HDMI1_TX2_N, HDMI1_TX2_P
mark named DIFFPAIR_90R: USB_D_N, USB_D_P, ~{PCIE_CLK}_N, ~{PCIE_CLK}_P, ~{PCIE_RX}_N, ~{PCIE_RX}_P, ~{PCIE_TX}_N, ~{PCIE_TX}_P
net class SPI_CLK: GPIO21
net class SPI_DATA: GPIO19, GPIO20

### Notes on the sheet
- Reccomended
- Connect to CM4_1V8 or CM4_3V3
- PWR IN
- We're not using cameras.
- PWR OUTs
- https://datasheets.raspberrypi.org/cm4/cm4-datasheet.pdf
- Labels drawn without touching a wire or pin: CAM0_C_N, CAM0_C_P, CAM0_D0_N, CAM0_D0_P, CAM0_D1_N, CAM0_D1_P, CAM1_C_N, CAM1_C_P, CAM1_D0_N, CAM1_D0_P, CAM1_D1_N, CAM1_D1_P, CAM1_D2_N, CAM1_D2_P, CAM1_D3_N, CAM1_D3_P, DSI0_C_N, DSI0_C_P, DSI0_D0_N, DSI0_D0_P, DSI0_D1_N, DSI0_D1_P, DSI1_C_N, DSI1_C_P, DSI1_D0_N, DSI1_D0_P, DSI1_D1_N, DSI1_D1_P, DSI1_D2_N, DSI1_D2_P, DSI1_D3_N, DSI1_D3_P, ETH_GB_0N, ETH_GB_0P, ETH_GB_1N, ETH_GB_1P, ETH_GB_2N, ETH_GB_2P, ETH_GB_3N, ETH_GB_3P, HDMI0_CLK_N, HDMI0_CLK_P, HDMI0_TX0_N, HDMI0_TX0_P, HDMI0_TX1_N, HDMI0_TX1_P, HDMI0_TX2_N, HDMI0_TX2_P, HDMI1_CLK_N, HDMI1_CLK_P, HDMI1_TX0_N, HDMI1_TX0_P, HDMI1_TX1_N, HDMI1_TX1_P, HDMI1_TX2_N, HDMI1_TX2_P, USB_D_N, USB_D_P, ~{PCIE_CLK}_N, ~{PCIE_CLK}_P, ~{PCIE_RX}_N, ~{PCIE_RX}_P, ~{PCIE_TX}_N, ~{PCIE_TX}_P
- FILE NAME
- PROJECT
- TITLE
- REV
- AUTHOR
- SIZE
- SHEET
- DATE
- OF
- A3
- (in symbol LEDS1-4-26) 6.4mm

### Library data of the parts
D7 = TJ-L3FYTGCBMCGSFLC6B-A5: LED 3mm Blue 460nm~470nm 2.7V~3.6V Through Hole Light Emitting Diodes (LED) RoHS C330760
J1 J2 = DF40HC(3.0)-100DS-0.4V(51: Conn Board to Board RCP 100 POS 0.4mm Solder ST SMD T/R
J17 = LEDS1-4-26: 3mm LED spacer 6.4mm height
J40 = B2B-XH-A (LF)(SN): Pin Header, Vertical, Wire-to-Board, 2.5 mm, 1 Rows, 2 Contacts, Through Hole Straight, XH Series
Q3 = PMBT3904,215: as Q10 on sheet OpenPLCv0.2.0_TopLevel
R43 R70 = 470R 0402 1% 1W: 470Ω ±1% 1/16W ±100ppm/℃ 0402 Chip Resistor - Surface Mount RoHS; Power Rating: 1W; Package: 0402; Tolerance: 1%
R71 = 10K 0402 1% 1/16W: as R79 on sheet OpenPLCv0.2.0_TopLevel; Package: 0402; Tolerance: 1%; Power Rating: 1/16W
R90 R91 = 0R 0402 1% 1/16W: 0Ω ±1% 1/16W 0402 Chip Resistor - Surface Mount RoHS; Package: 0402; Tolerance: 1%; Power Rating: 1/16W

## Sheet OpenPLCv0.2.0_AnalogueOutput.SchDoc
size 420 x 297 mm; PageSetup: Record=PageOptions|CenterHorizontal=True|CenterVertical=True|PrintScale=1.01|XCorrection=1.00|YCorrection=1.00|PrintKind=1|BorderSize=5000000|LeftOffset=0|BottomOffset=0|Orientation=2|PaperLength=1000|PaperWidth=1000|Scale=100|PaperSource=7|PrintQuality=-4|MediaType=1|DitherType=10|PaperKind=A3|PrintScaleMode=1; DocumentNumber: 4; SheetNumber: 4; SheetTotal: 22; SheetTitle: Analogue Output
Used 2 times, as channels AO1, AO2. Parts and nets are listed once, with the designators drawn on the sheet.
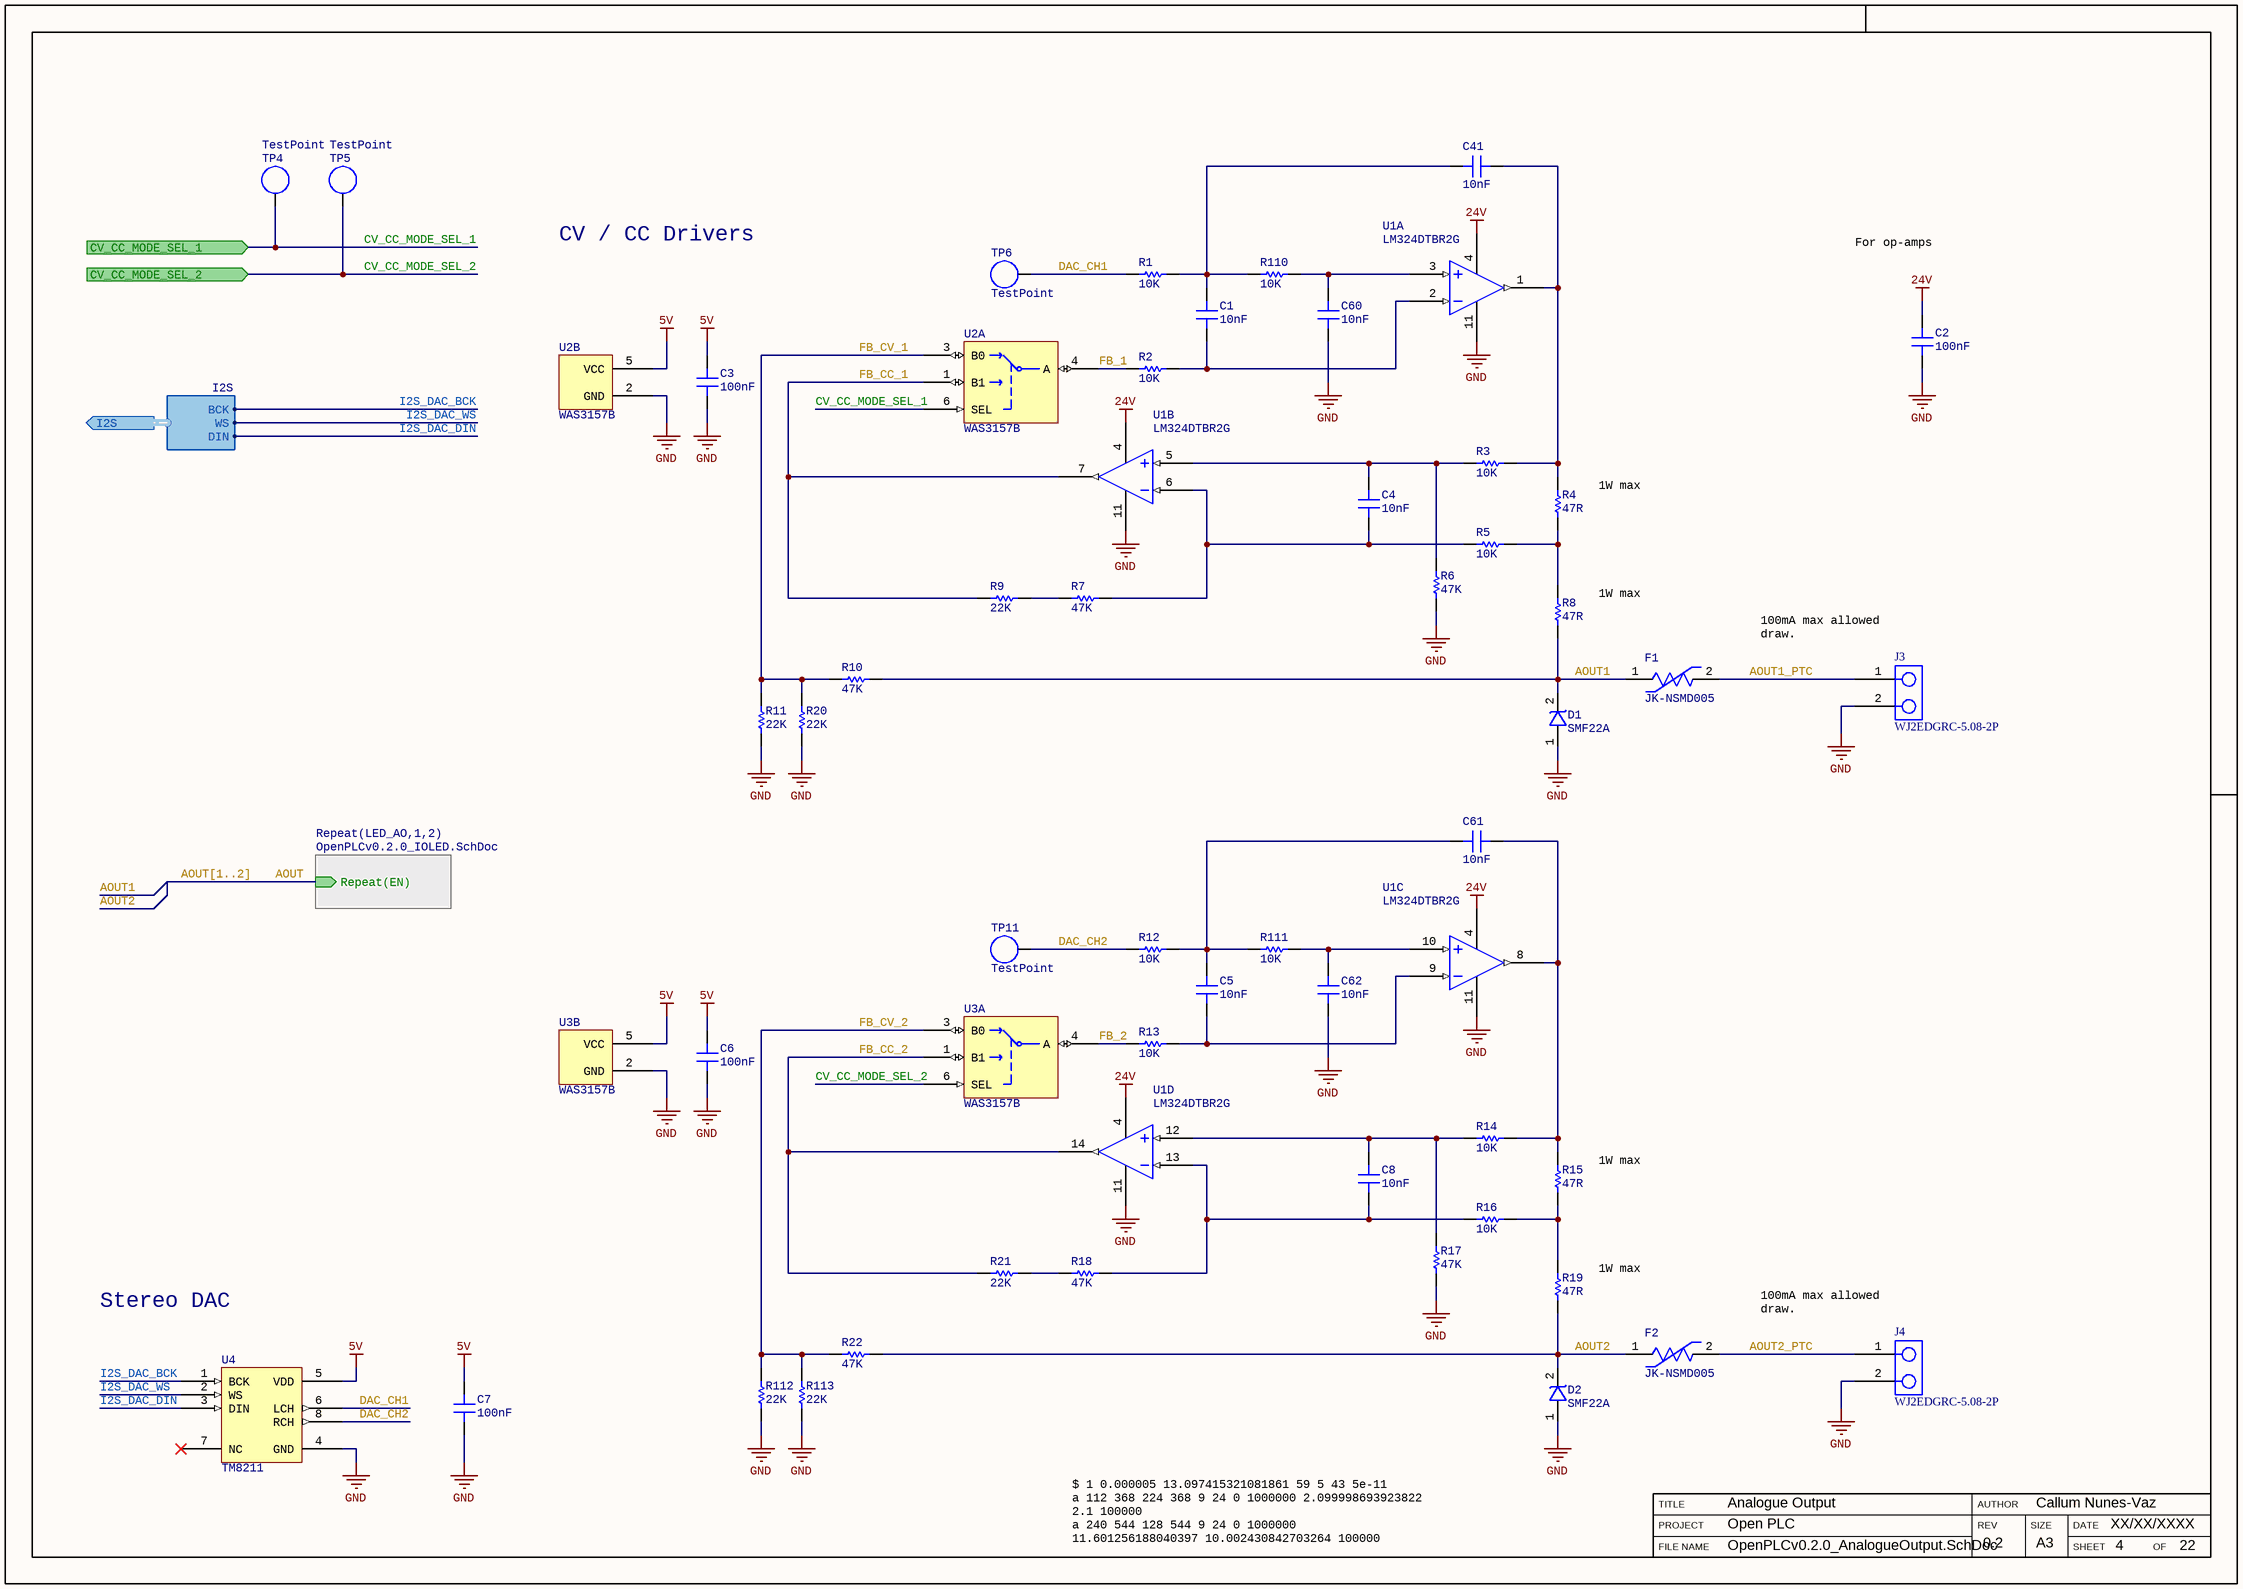
[diagram p2: OpenPLCv0.2.0_AnalogueOutput.SchDoc]

### Parts
C1  Capacitance: 10nF  [SMD_CAP_0402(1005)_N]  (hidden comment: CC0402KRX7R9BB103)
C2  Capacitance: 100nF  [SMD_CAP_0402(1005)_N]  (hidden comment: CC0402KRX5R9BB104)
C3  Capacitance: 100nF  [SMD_CAP_0402(1005)_N]  (hidden comment: CC0402KRX5R6BB104)
C4  Capacitance: 10nF  [SMD_CAP_0402(1005)_N]  (hidden comment: CC0402KRX7R9BB103)
C5  Capacitance: 10nF  [SMD_CAP_0402(1005)_N]  (hidden comment: CC0402KRX7R9BB103)
C6  Capacitance: 100nF  [SMD_CAP_0402(1005)_N]  (hidden comment: CC0402KRX5R6BB104)
C7  Capacitance: 100nF  [SMD_CAP_0402(1005)_N]  (hidden comment: CC0402KRX5R6BB104)
C8  Capacitance: 10nF  [SMD_CAP_0402(1005)_N]  (hidden comment: CC0402KRX7R9BB103)
C41  Capacitance: 10nF  [SMD_CAP_0402(1005)_N]  (hidden comment: CC0402KRX7R9BB103)
C60  Capacitance: 10nF  [SMD_CAP_0402(1005)_N]  (hidden comment: CC0402KRX7R9BB103)
C61  Capacitance: 10nF  [SMD_CAP_0402(1005)_N]  (hidden comment: CC0402KRX7R9BB103)
C62  Capacitance: 10nF  [SMD_CAP_0402(1005)_N]  (hidden comment: CC0402KRX7R9BB103)
D1  SMF22A  [SOD-123FL]
D2  SMF22A  [SOD-123FL]
F1  JK-NSMD005  [SMD_RES_1206(3216)_N]
F2  JK-NSMD005  [SMD_RES_1206(3216)_N]
J3  WJ2EDGRC-5.08-2P  [796638-2_BoardEdgeAlt]
J4  WJ2EDGRC-5.08-2P  [796638-2_BoardEdgeAlt]
R1  Resistance: 10K  [SMD_RES_0402(1005)_N]  (hidden comment: RC0402FR-0710KL)
R2  Resistance: 10K  [SMD_RES_0402(1005)_N]  (hidden comment: RC0402FR-0710KL)
R3  Resistance: 10K  [SMD_RES_0402(1005)_N]  (hidden comment: RC0402FR-0710KL)
R4  Resistance: 47R  [SMD_RES_2512(6432)_N]  (hidden comment: AC2512FK-0747RL)
R5  Resistance: 10K  [SMD_RES_0402(1005)_N]  (hidden comment: RC0402FR-0710KL)
R6  Resistance: 47K  [SMD_RES_0402(1005)_N]  (hidden comment: RC0402FR-0747KL)
R7  Resistance: 47K  [SMD_RES_0402(1005)_N]  (hidden comment: RC0402FR-0747KL)
R8  Resistance: 47R  [SMD_RES_2512(6432)_N]  (hidden comment: AC2512FK-0747RL)
R9  Resistance: 22K  [SMD_RES_0402(1005)_N]  (hidden comment: RC0402FR-0722KL)
R10  Resistance: 47K  [SMD_RES_0402(1005)_N]  (hidden comment: RC0402FR-0747KL)
R11  Resistance: 22K  [SMD_RES_0402(1005)_N]  (hidden comment: RC0402FR-0722KL)
R12  Resistance: 10K  [SMD_RES_0402(1005)_N]  (hidden comment: RC0402FR-0710KL)
R13  Resistance: 10K  [SMD_RES_0402(1005)_N]  (hidden comment: RC0402FR-0710KL)
R14  Resistance: 10K  [SMD_RES_0402(1005)_N]  (hidden comment: RC0402FR-0710KL)
R15  Resistance: 47R  [SMD_RES_2512(6432)_N]  (hidden comment: AC2512FK-0747RL)
R16  Resistance: 10K  [SMD_RES_0402(1005)_N]  (hidden comment: RC0402FR-0710KL)
R17  Resistance: 47K  [SMD_RES_0402(1005)_N]  (hidden comment: RC0402FR-0747KL)
R18  Resistance: 47K  [SMD_RES_0402(1005)_N]  (hidden comment: RC0402FR-0747KL)
R19  Resistance: 47R  [SMD_RES_2512(6432)_N]  (hidden comment: AC2512FK-0747RL)
R20  Resistance: 22K  [SMD_RES_0402(1005)_N]  (hidden comment: RC0402FR-0722KL)
R21  Resistance: 22K  [SMD_RES_0402(1005)_N]  (hidden comment: RC0402FR-0722KL)
R22  Resistance: 47K  [SMD_RES_0402(1005)_N]  (hidden comment: RC0402FR-0747KL)
R110  Resistance: 10K  [SMD_RES_0402(1005)_N]  (hidden comment: RC0402FR-0710KL)
R111  Resistance: 10K  [SMD_RES_0402(1005)_N]  (hidden comment: RC0402FR-0710KL)
R112  Resistance: 22K  [SMD_RES_0402(1005)_N]  (hidden comment: RC0402FR-0722KL)
R113  Resistance: 22K  [SMD_RES_0402(1005)_N]  (hidden comment: RC0402FR-0722KL)
TP4  TestPoint  [Pad]  (no BOM)
TP5  TestPoint  [Pad]  (no BOM)
TP6  TestPoint  [Pad]  (no BOM)
TP11  TestPoint  [Pad]  (no BOM)
U1  LM324DTBR2G  [TSSOP-14]  (parts A,B,C,D of 4)
U2  WAS3157B  [SOT23-6]  (parts A,B of 2)
U3  WAS3157B  [SOT23-6]  (parts A,B of 2)
U4  TM8211  [SOIC-8-3.9mm]

### Sub-sheets
Repeat(LED_AO,1,2) = OpenPLCv0.2.0_IOLED.SchDoc: Repeat(EN) (in)

### Ports
CV_CC_MODE_SEL_1 (in), CV_CC_MODE_SEL_2 (in), I2S (out, harness I2S)

### Harnesses
I2S: WS, BCK, DIN

### Nets
5V: C3.2 C6.2 C7.2 U2.5(VCC) U3.5(VCC) U4.5(VDD)
24V: C2.2 U1.4(VDD)
GND: C2.1 C3.1 C6.1 C7.1 C60.2 C62.2 D1.1(ANODE) D2.1(ANODE) J3.2 J4.2 R6.1 R11.1 R17.1 R20.1 R112.1 R113.1 U1.11(VSS) U2.2(GND) U3.2(GND) U4.4(GND)
AOUT: sheet Repeat(LED_AO,1,2)/Repeat(EN)
AOUT1: D1.2(CATHODE) F1.1 R8.1 R10.2
AOUT1_PTC: F1.2 J3.1
AOUT2: D2.2(CATHODE) F2.1 R19.1 R22.2
AOUT2_PTC: F2.2 J4.1
CV_CC_MODE_SEL_1: TP4.1 U2.6(SEL) ; port CV_CC_MODE_SEL_1
CV_CC_MODE_SEL_2: TP5.1 U3.6(SEL) ; port CV_CC_MODE_SEL_2
DAC_CH1: R1.1 TP6.1 U4.6(LCH)
DAC_CH2: R12.1 TP11.1 U4.8(RCH)
FB_1: R2.1 U2.4(A)
FB_2: R13.1 U3.4(A)
FB_CC_1: R9.2 U1.7(VOUT) U2.1(B1)
FB_CC_2: R21.2 U1.14(VOUT) U3.1(B1)
FB_CV_1: R10.1 R11.2 R20.2 U2.3(B0)
FB_CV_2: R22.1 R112.2 R113.2 U3.3(B0)
I2S_DAC_BCK: U4.1(BCK) ; port I2S.BCK
I2S_DAC_DIN: U4.3(DIN) ; port I2S.DIN
I2S_DAC_WS: U4.2(WS) ; port I2S.WS
NetC1_1: C1.1 R2.2 U1.2(VIN-)
NetC1_2: C1.2 C41.2 R1.2 R110.1
NetC4_1: C4.1 R5.1 R7.2 U1.6(VIN-)
NetC4_2: C4.2 R3.1 R6.2 U1.5(VIN+)
NetC5_1: C5.1 R13.2 U1.9(VIN-)
NetC5_2: C5.2 C61.2 R12.2 R111.1
NetC8_1: C8.1 R16.1 R18.2 U1.13(VIN-)
NetC8_2: C8.2 R14.1 R17.2 U1.12(VIN+)
NetC41_1: C41.1 R3.2 R4.2 U1.1(VOUT)
NetC60_1: C60.1 R110.2 U1.3(VIN+)
NetC61_1: C61.1 R14.2 R15.2 U1.8(VOUT)
NetC62_1: C62.1 R111.2 U1.10(VIN+)
NetR4_1: R4.1 R5.2 R8.2
NetR7_1: R7.1 R9.1
NetR15_1: R15.1 R16.2 R19.2
NetR18_1: R18.1 R21.1

Not connected (* = marked no-connect by the designer): U4 7(NC)*

### Channels
AO1: designators end in _1; ports CV_CC_MODE_SEL_1=CV_CC_MODE_SEL_1 CV_CC_MODE_SEL_2=CV_CC_MODE_SEL_2
AO2: designators end in _2; ports CV_CC_MODE_SEL_1=CV_CC_MODE_SEL_1 CV_CC_MODE_SEL_2=CV_CC_MODE_SEL_2

### Buses and harness runs
bus AOUT[1..2]

### Notes on the sheet
- CV / CC Drivers
- For op-amps
- (near R4) 1W max
- (near R8) 1W max
- (near J3) 100mA max allowed draw.
- (near R15) 1W max
- Stereo DAC
- (near R19) 1W max
- (near J4) 100mA max allowed draw.
- $ 1 0.000005 13.097415321081861 59 5 43 5e-11
  a 112 368 224 368 9 24 0 1000000 2.099998693923822 2.1 100000
  a 240 544 128 544 9 24 0 1000000 11.601256188040397 10.002430842703264 100000
  r 112 384 -80 384 0 10000
  w 112 352 -144 352 0
  R -144 352 -144 304 0 0 40 2.1 0 0 0.5
  w -80 544 128 544 0
  w 32 544 32 624 0
  r 144 624 256 624 0 47000
  w 256 624 256 592 0
  w 240 528 288 528 0
  w 240 560 256 560 0
  w 256 560 256 592 0
  w 256 592 320 592 0
  w 288 528 320 528 0
  r 320 528 464 528 0 10000
  r 320 592 464 592 0 10000
  r 464 592 464 528 0 47
  r 464 592 464 736 0 47
  w -128 384 -80 384 0
  w 224 368 464 368 0
  w 464 368 464 528 0
  368 464 736 528 736 0 0
  r 464 848 464 944 0 1000
  g 464 944 464 960 0 0
  w 464 736 -32 736 0
  w 288 528 288 608 0
  r 288 608 288 672 0 47000
  g 288 672 288 688 0 0
  r -80 544 -80 448 0 1
  370 464 736 464 848 1 0 0
  s -80 384 -80 448 0 1 false
  s -128 384 -128 448 0 0 false
  368 -128 384 -192 384 0 0
  r -128 864 -128 928 0 11000
  g -128 928 -128 960 0 0
  r -128 736 -128 864 0 1
  368 -80 544 -80 592 0 0
  r -128 448 -128 544 0 1
  w -128 544 -128 736 0
  368 464 368 528 368 0 0
  368 -128 864 -192 864 0 0
  r -32 736 -128 736 0 47000
  r 144 624 32 624 0 22000
  o 24 64 0 4099 20 0.0001953125 0 2 24 3
  38 4 F1 0 0 5 -1 Voltage
  38 22 F1 0 1 1000 -1 Resistance
- FILE NAME
- PROJECT
- TITLE
- REV
- AUTHOR
- SIZE
- SHEET
- DATE
- OF
- A3

### Library data of the parts
C1 C4 C5 C8 C41 C60-C62 = 10nF 0402 50V 10%: 10nF ±10% 50V X7R 0402 Multilayer Ceramic Capacitors MLCC - SMD/SMT RoHS; Package: 0402; Tolerance: 10%; Voltage Rating: 50V
C2 = 100nF 0402 50V 10%: 100nF ±10% 50V X5R 0402 Multilayer Ceramic Capacitors MLCC - SMD/SMT RoHS; Package: 0402; Tolerance: 10%; Voltage Rating: 50V
C3 C6 C7 = 100nF 0402 10V 10%: 100nF ±10% 10V X5R 0402 Multilayer Ceramic Capacitors MLCC - SMD/SMT RoHS; Package: 0402; Tolerance: 10%; Voltage Rating: 10V
D1 D2 = SMF22A: Unidirectional 22V 24.4V 35.5V 5.6A SOD-123F TVS RoHS
F1 F2 = JK-NSMD005: 60V 150mA 1.5s 1206 PTC Resettable Fuses RoHS
J3 J4 = WJ2EDGRC-5.08-2P: Covered（4Sided） 2 1 0.200"（5.08mm） 2 P=5.08mm Pluggable System Terminal Block RoHS
R1-R3 R5 R12-R14 R16 R110 R111 = 10K 0402 1% 1/16W: as R79 on sheet OpenPLCv0.2.0_TopLevel; Package: 0402; Tolerance: 1%; Power Rating: 1/16W
R4 R8 R15 R19 = 47R 2512 1% 1W: 47Ω ±1% 1W ±100ppm/℃ 2512 Chip Resistor - Surface Mount RoHS; Package: 2512; Tolerance: 1%; Power Rating: 1W
R6 R7 R10 R17 R18 R22 = 47K 0402 1% 1/16W: 47kΩ ±1% 1/16W ±100ppm/℃ 0402 Chip Resistor - Surface Mount RoHS; Package: 0402; Tolerance: 1%; Power Rating: 1/16W
R9 R11 R20 R21 R112 R113 = 22K 0402 1% 1/16W: 22kΩ ±1% 1/16W ±100ppm/℃ 0402 Chip Resistor - Surface Mount RoHS; Package: 0402; Tolerance: 1%; Power Rating: 1/16W
TP4-TP6 TP11 = Test point
U1 = LM324DTBR2G: General Purpose 4 3V ~ 32V, ±1.5V ~ 16V 1MHz 0.6 V/us TSSOP-14 Operational Amplifiers RoHS
U2 U3 = WAS3157B: 5.5Ω, 400MHz Bandwidth, SPDT Analog Switch SOT23-6
U4 = TM8211: Digital To Analog Converters (DACs) 16bit I2S

## Sheet OpenPLCv0.2.0_IOLED.SchDoc
size 420 x 297 mm; DocumentNumber: 13; SheetNumber: 13; SheetTotal: 22; SheetTitle: IO Green LED
Used 8 times, as channels AO1/LED_AO1, AO1/LED_AO2, AO2/LED_AO1, AO2/LED_AO2, AI/LED_AI1, AI/LED_AI2, AI/LED_AI3, AI/LED_AI4. Parts and nets are listed once, with the designators drawn on the sheet.
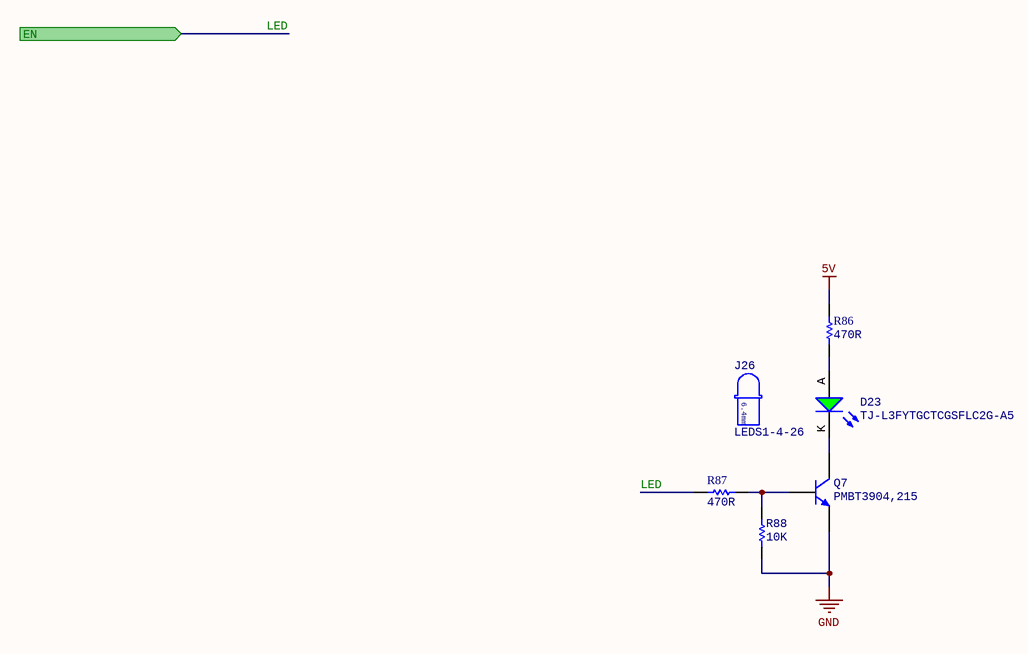
[diagram p3: OpenPLCv0.2.0_IOLED.SchDoc]

### Parts
D23  TJ-L3FYTGCTCGSFLC2G-A5  [LED_3MM_SPACED_6.4MM_GREEN]
J26  LEDS1-4-26  [3MM_LED_SPACER_6.4MM]
Q7  PMBT3904,215  [SOT23-3]
R86  Resistance: 470R  [SMD_RES_0402(1005)_N]  (hidden comment: RC0402FR-07470RL)
R87  Resistance: 470R  [SMD_RES_0402(1005)_N]  (hidden comment: RC0402FR-07470RL)
R88  Resistance: 10K  [SMD_RES_0402(1005)_N]  (hidden comment: RC0402FR-0710KL)

### Ports
EN (in)

### Nets
5V: R86.2
GND: Q7.2(E) R88.1
LED: R87.2 ; port EN
NetD23_A: D23.A R86.1
NetD23_K: D23.K Q7.3(C)
NetQ7_1: Q7.1(B) R87.1 R88.2

### Channels
AO1/LED_AO1: designators end in _1; ports EN=AOUT1_AO1
AO1/LED_AO2: designators end in _2; ports EN=AOUT2_AO1
AO2/LED_AO1: designators end in _3; ports EN=AOUT1_AO2
AO2/LED_AO2: designators end in _4; ports EN=AOUT2_AO2
AI/LED_AI1: designators end in _5; ports EN=ADC_IN1
AI/LED_AI2: designators end in _6; ports EN=ADC_IN2
AI/LED_AI3: designators end in _7; ports EN=ADC_IN3
AI/LED_AI4: designators end in _8; ports EN=ADC_IN4

### Notes on the sheet
- FILE NAME
- PROJECT
- TITLE
- REV
- AUTHOR
- SIZE
- SHEET
- DATE
- OF
- A3
- (in symbol LEDS1-4-26) 6.4mm

### Library data of the parts
D23 = TJ-L3FYTGCTCGSFLC2G-A5: LED 3mm Green 515nm~530nm 1.8V~3.6V Through Hole Light Emitting Diodes (LED) RoHS C330751
J26 = LEDS1-4-26: 3mm LED spacer 6.4mm height
Q7 = PMBT3904,215: as Q10 on sheet OpenPLCv0.2.0_TopLevel
R86 R87 = 470R 0402 1% 1W: as R43 on sheet OpenPLCv0.2.0_ComputeModule; Package: 0402; Tolerance: 1%
R88 = 10K 0402 1% 1/16W: as R79 on sheet OpenPLCv0.2.0_TopLevel; Package: 0402; Tolerance: 1%; Power Rating: 1/16W

## Sheet OpenPLCv0.2.0_IOController.SchDoc
size 420 x 297 mm; DocumentNumber: 12; SheetNumber: 12; SheetTotal: 22; SheetTitle: IO Controller
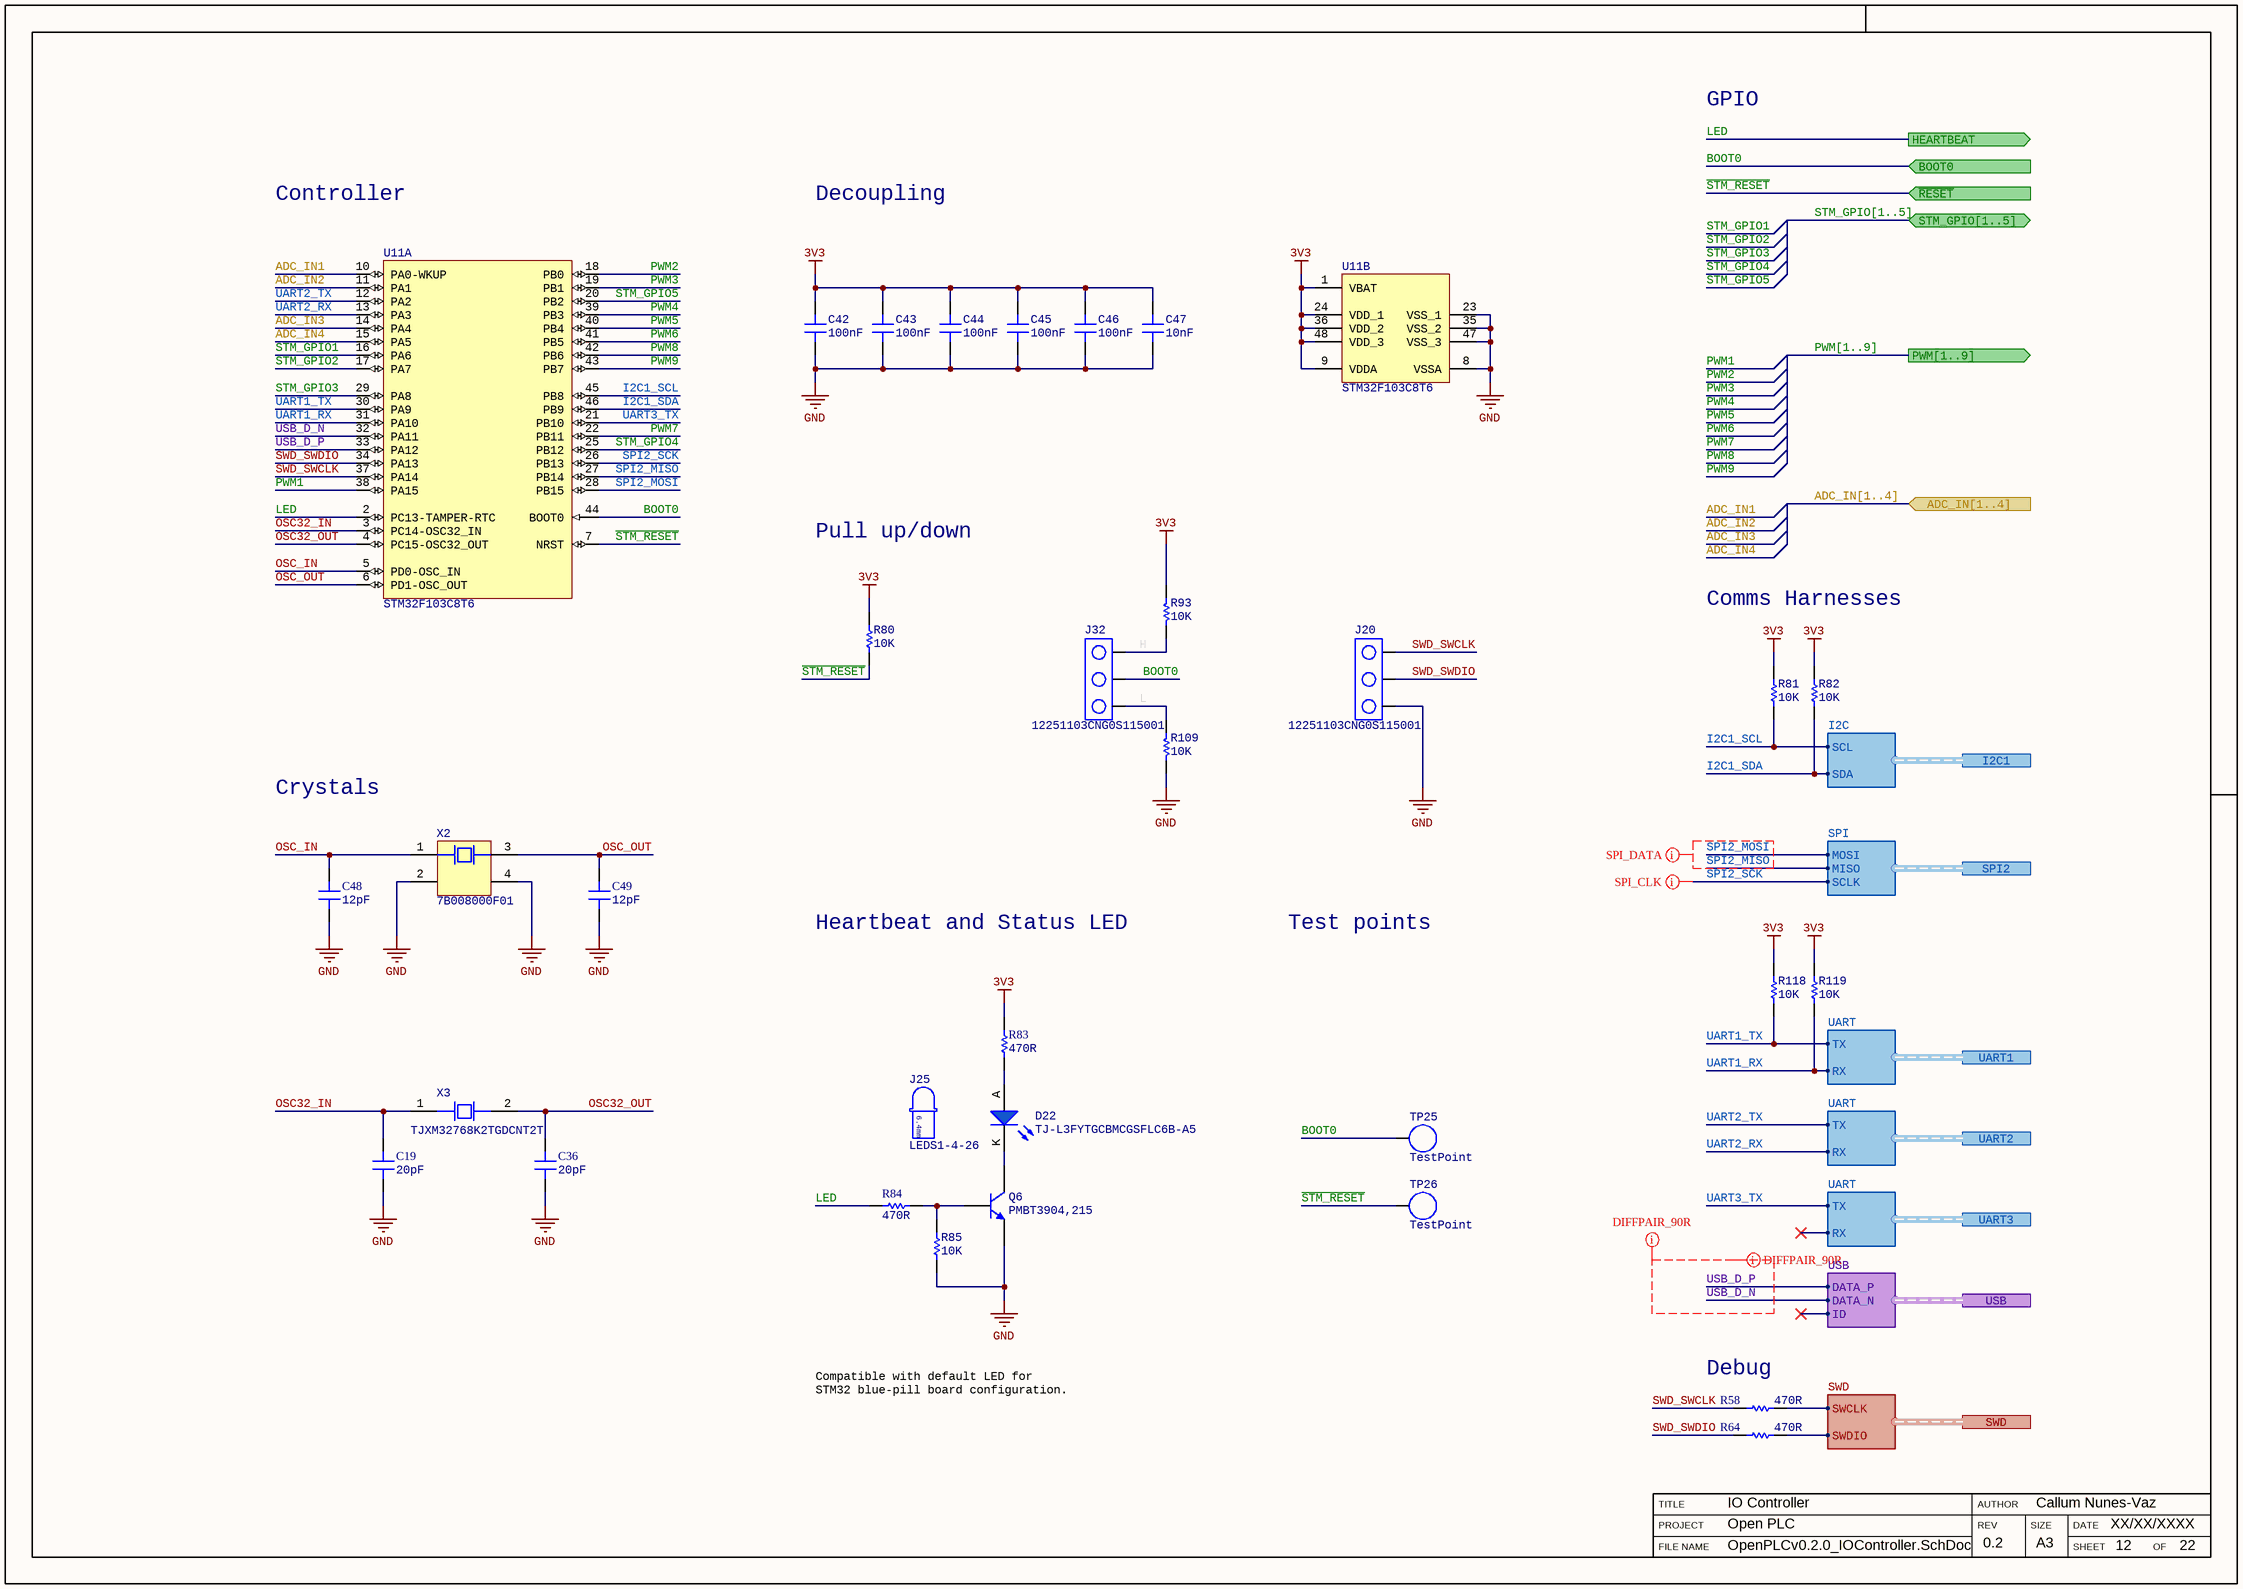
[diagram p4: OpenPLCv0.2.0_IOController.SchDoc]

### Parts
C19  Capacitance: 20pF  [SMD_CAP_0402(1005)_N]  (hidden comment: CC0402JRNPO9BN200)
C36  Capacitance: 20pF  [SMD_CAP_0402(1005)_N]  (hidden comment: CC0402JRNPO9BN200)
C42  Capacitance: 100nF  [SMD_CAP_0402(1005)_N]  (hidden comment: CC0402KRX5R6BB104)
C43  Capacitance: 100nF  [SMD_CAP_0402(1005)_N]  (hidden comment: CC0402KRX5R6BB104)
C44  Capacitance: 100nF  [SMD_CAP_0402(1005)_N]  (hidden comment: CC0402KRX5R6BB104)
C45  Capacitance: 100nF  [SMD_CAP_0402(1005)_N]  (hidden comment: CC0402KRX5R6BB104)
C46  Capacitance: 100nF  [SMD_CAP_0402(1005)_N]  (hidden comment: CC0402KRX5R6BB104)
C47  Capacitance: 10nF  [SMD_CAP_0402(1005)_N]  (hidden comment: CC0402KRX7R9BB103)
C48  Capacitance: 12pF  [SMD_CAP_0402(1005)_N]  (hidden comment: CC0402JRNPO9BN120)
C49  Capacitance: 12pF  [SMD_CAP_0402(1005)_N]  (hidden comment: CC0402JRNPO9BN120)
D22  TJ-L3FYTGCBMCGSFLC6B-A5  [LED_3MM_SPACED_6.4MM_BLUE]
J20  12251103CNG0S115001  [Header_3POS]
J25  LEDS1-4-26  [3MM_LED_SPACER_6.4MM]
J32  12251103CNG0S115001  [Header_3POS]
Q6  PMBT3904,215  [SOT23-3]
R58  Resistance: 470R  [SMD_RES_0402(1005)_N]  (hidden comment: RC0402FR-07470RL)
R64  Resistance: 470R  [SMD_RES_0402(1005)_N]  (hidden comment: RC0402FR-07470RL)
R80  Resistance: 10K  [SMD_RES_0402(1005)_N]  (hidden comment: RC0402FR-0710KL)
R81  Resistance: 10K  [SMD_RES_0402(1005)_N]  (hidden comment: RC0402FR-0710KL)
R82  Resistance: 10K  [SMD_RES_0402(1005)_N]  (hidden comment: RC0402FR-0710KL)
R83  Resistance: 470R  [SMD_RES_0402(1005)_N]  (hidden comment: RC0402FR-07470RL)
R84  Resistance: 470R  [SMD_RES_0402(1005)_N]  (hidden comment: RC0402FR-07470RL)
R85  Resistance: 10K  [SMD_RES_0402(1005)_N]  (hidden comment: RC0402FR-0710KL)
R93  Resistance: 10K  [SMD_RES_0402(1005)_N]  (hidden comment: RC0402FR-0710KL)
R109  Resistance: 10K  [SMD_RES_0402(1005)_N]  (hidden comment: RC0402FR-0710KL)
R118  Resistance: 10K  [SMD_RES_0402(1005)_N]  (hidden comment: RC0402FR-0710KL)
R119  Resistance: 10K  [SMD_RES_0402(1005)_N]  (hidden comment: RC0402FR-0710KL)
TP25  TestPoint  [Pad]  (no BOM)
TP26  TestPoint  [Pad]  (no BOM)
U11  STM32F103C8T6  [LQFP32_7x7]  (parts A,B of 2)
X2  7B008000F01  [CRYSTAL_3225]
X3  TJXM32768K2TGDCNT2T  [CRYSTAL_2012]

### Ports
ADC_IN[1..4] (in), BOOT0 (in), HEARTBEAT (out), I2C1 (harness I2C), PWM[1..9] (out), SPI2 (harness SPI), STM_GPIO[1..5] (bidir), SWD (harness SWD), UART1 (harness UART), UART2 (harness UART), UART3 (harness UART), USB (harness USB), ~{RESET} (in)

### Harnesses
I2C: SCL, SDA
SWD: SWCLK, SWDIO
UART: TX, RX
SPI: MOSI, MISO, SCLK
USB: DATA_P, DATA_N, ID

### Nets
3V3: C42.2 C43.2 C44.2 C45.2 C46.2 C47.2 R80.2 R81.2 R82.2 R83.1 R93.2 R118.2 R119.2 U11.1(VBAT) U11.9(VDDA) U11.24(VDD_1) U11.36(VDD_2) U11.48(VDD_3)
GND: C19.1 C36.1 C42.1 C43.1 C44.1 C45.1 C46.1 C47.1 C48.1 C49.1 J20.3 Q6.2(E) R85.1 R109.1 U11.8(VSSA) U11.23(VSS_1) U11.35(VSS_2) U11.47(VSS_3) X2.2 X2.4
ADC_IN1: U11.10(PA0-WKUP)
ADC_IN2: U11.11(PA1)
ADC_IN3: U11.14(PA4)
ADC_IN4: U11.15(PA5)
BOOT0: J32.2 TP25.1 U11.44(BOOT0) ; port BOOT0
GPIO7: R58.2 ; port SWD.SWCLK
GPIO10: R64.2 ; port SWD.SWDIO
H: J32.1 R93.1
I2C1_SCL: R81.1 U11.45(PB8) ; port I2C1.SCL  [project net I2C.SCL]
I2C1_SDA: R82.1 U11.46(PB9) ; port I2C1.SDA  [project net I2C.SDA]
L: J32.3 R109.2
LED: R84.2 U11.2(PC13-TAMPER-RTC) ; port HEARTBEAT
OSC32_IN: C19.2 U11.3(PC14-OSC32_IN) X3.1
OSC32_OUT: C36.2 U11.4(PC15-OSC32_OUT) X3.2
OSC_IN: C48.2 U11.5(PD0-OSC_IN) X2.1
OSC_OUT: C49.2 U11.6(PD1-OSC_OUT) X2.3
PWM1: U11.38(PA15)  [project net BO_EN]
PWM2: U11.18(PB0)  [project net BO_EN]
PWM3: U11.19(PB1)  [project net BO_EN]
PWM4: U11.39(PB3)  [project net BO_EN]
PWM5: U11.40(PB4)  [project net BO_EN]
PWM6: U11.41(PB5)  [project net BO_EN]
PWM7: U11.22(PB11)  [project net BO_EN]
PWM8: U11.42(PB6)  [project net BO_EN]
PWM9: U11.43(PB7)
~{STM_RESET}: R80.1 TP26.1 U11.7(NRST) ; port ~{RESET}  [project net ~{RESET}]
SPI2_MISO: U11.27(PB14) ; port SPI2.MISO  [project net MCU_SPI_MISO]
SPI2_MOSI: U11.28(PB15) ; port SPI2.MOSI  [project net MCU_SPI_MOSI]
SPI2_SCK: U11.26(PB13) ; port SPI2.SCLK
STM_GPIO1: U11.16(PA6)  [project net ~{INT}]
STM_GPIO2: U11.17(PA7)  [project net I2S_DAC_BCK]
STM_GPIO3: U11.29(PA8)  [project net I2S_DAC_WS]
STM_GPIO4: U11.25(PB12)  [project net I2S_DAC_DIN]
STM_GPIO5: U11.20(PB2)  [project net I2S_DAC_BCK]
SWD_SWCLK: J20.1 R58.1 U11.37(PA14)
SWD_SWDIO: J20.2 R64.1 U11.34(PA13)
UART1_RX: R119.1 U11.31(PA10) ; port UART1.RX  [project net GPIO5]
UART1_TX: R118.1 U11.30(PA9) ; port UART1.TX  [project net GPIO4]
UART2_RX: U11.13(PA3) ; port UART2.RX  [project net MCU_UART_RX]
UART2_TX: U11.12(PA2) ; port UART2.TX  [project net MCU_UART_TX]
UART3_TX: U11.21(PB10) ; port UART3.TX  [project net STM_UART3.TX]
USB_D_N: U11.32(PA11) ; port USB.DATA_N  [project net STM_USB_MCU.DATA_N]
USB_D_P: U11.33(PA12) ; port USB.DATA_P  [project net STM_USB_MCU.DATA_P]
NetD22_A: D22.A R83.2
NetD22_K: D22.K Q6.3(C)
NetQ6_1: Q6.1(B) R84.1 R85.2

### Buses and harness runs
bus ADC_IN[1..4] = port ADC_IN[1..4]
bus PWM[1..9] = port PWM[1..9]
bus STM_GPIO[1..5] = port STM_GPIO[1..5]

### Layout directives
net class SPI_DATA: SPI2_MISO, SPI2_MOSI
differential pair; differential pair class 90R_DIFF_PAIRS; net class 90R_PAIRS: USB_D_N, USB_D_P
mark named DIFFPAIR_90R: USB_D_N, USB_D_P
net class SPI_CLK: SPI2_SCK

### Notes on the sheet
- GPIO
- Controller
- Decoupling
- Pull up/down
- Comms Harnesses
- Crystals
- Heartbeat and Status LED
- Test points
- Compatible with default LED for STM32 blue-pill board configuration.
- (near R58) Debug
- FILE NAME
- PROJECT
- TITLE
- REV
- AUTHOR
- SIZE
- SHEET
- DATE
- OF
- A3
- (in symbol LEDS1-4-26) 6.4mm

### Library data of the parts
C19 C36 = 20pF 0402 50V 5%: 20pF ±5% 50V NP0 0402 Multilayer Ceramic Capacitors MLCC - SMD/SMT RoHS; Package: 0402; Tolerance: 5%; Voltage Rating: 50V
C42-C46 = 100nF 0402 10V 10%: as C3 on sheet OpenPLCv0.2.0_AnalogueOutput; Package: 0402; Tolerance: 10%; Voltage Rating: 10V
C47 = 10nF 0402 50V 10%: as C1 on sheet OpenPLCv0.2.0_AnalogueOutput; Package: 0402; Tolerance: 10%; Voltage Rating: 50V
C48 C49 = 12pF 0402 50V 5%: 12pF ±5% 50V NP0 0402 Multilayer Ceramic Capacitors MLCC - SMD/SMT RoHS; Package: 0402; Tolerance: 5%; Voltage Rating: 50V
D22 = TJ-L3FYTGCBMCGSFLC6B-A5: as D7 on sheet OpenPLCv0.2.0_ComputeModule
J20 J32 = 3-way Jumper: as J11 on sheet OpenPLCv0.2.0_TopLevel
J25 = LEDS1-4-26: 3mm LED spacer 6.4mm height
Q6 = PMBT3904,215: as Q10 on sheet OpenPLCv0.2.0_TopLevel
R58 R64 R83 R84 = 470R 0402 1% 1W: as R43 on sheet OpenPLCv0.2.0_ComputeModule; Package: 0402; Tolerance: 1%
R80-R82 R85 R93 R109 R118 R119 = 10K 0402 1% 1/16W: as R79 on sheet OpenPLCv0.2.0_TopLevel; Package: 0402; Tolerance: 1%; Power Rating: 1/16W
TP25 TP26 = Test point
U11 = STM32F103C8T6: Mainstream Performance line, Arm Cortex-M3 MCU with 64 Kbytes of Flash memory, 72 MHz CPU, motor control, USB and CAN
X2 = 7B008000F01: 8MHz ±10ppm 8pF 200Ω SMD-3225_4P SMD Crystal Resonators RoHS
X3 = TJXM32768K2TGDCNT2T: 32.768KHz ±20ppm 12.5pF 70kΩ SMD-2012_2P SMD Crystal Resonators RoHS

## Sheet OpenPLCv0.2.0_BinaryOut.SchDoc
size 420 x 297 mm; PageSetup: Record=PageOptions|CenterHorizontal=True|CenterVertical=True|PrintScale=1.01|XCorrection=1.00|YCorrection=1.00|PrintKind=1|BorderSize=5000000|LeftOffset=0|BottomOffset=0|Orientation=2|PaperLength=1000|PaperWidth=1000|Scale=100|PaperSource=7|PrintQuality=-4|MediaType=1|DitherType=10|PaperKind=A3|PrintScaleMode=1; DocumentNumber: 11; SheetNumber: 11; SheetTotal: 22; SheetTitle: Binary Output
Used 8 times, as channels BO1, BO2, BO3, BO4, BO5, BO6, BO7, BO8. Parts and nets are listed once, with the designators drawn on the sheet.
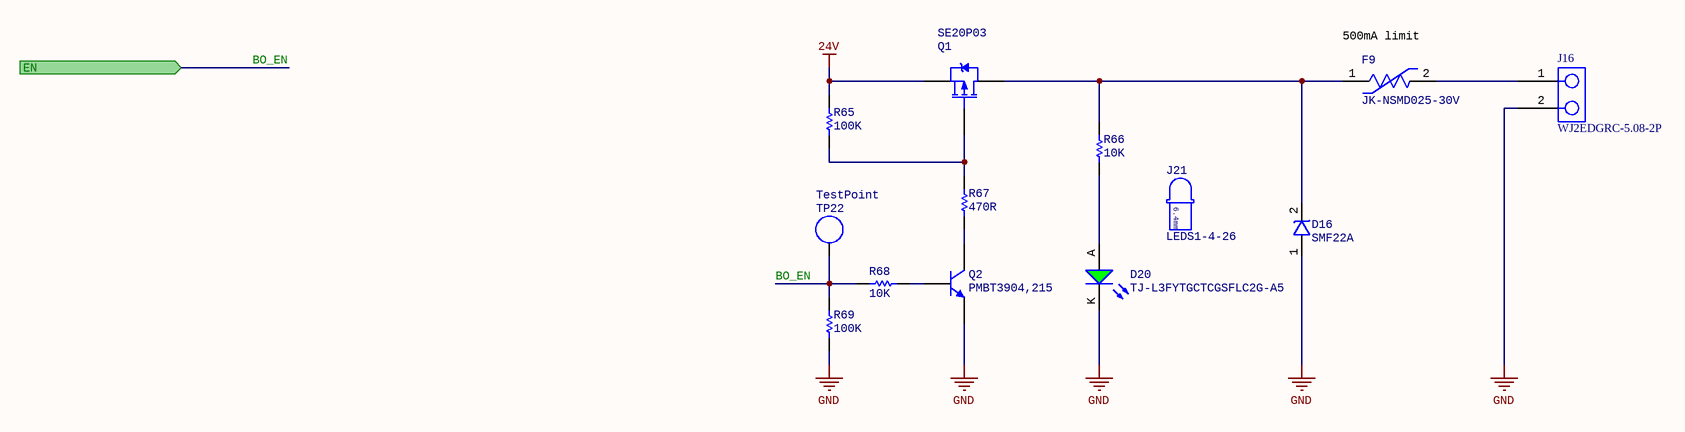
[diagram p5: OpenPLCv0.2.0_BinaryOut.SchDoc]

### Parts
D16  SMF22A  [SOD-123FL]
D20  TJ-L3FYTGCTCGSFLC2G-A5  [LED_3MM_SPACED_6.4MM_GREEN]
F9  JK-NSMD025-30V  [SMD_RES_1206(3216)_N]
J16  WJ2EDGRC-5.08-2P  [796638-2_BoardEdgeAlt]
J21  LEDS1-4-26  [3MM_LED_SPACER_6.4MM]
Q1  SE20P03  [TO-252]
Q2  PMBT3904,215  [SOT23-3]
R65  Resistance: 100K  [SMD_RES_0402(1005)_N]  (hidden comment: RC0402FR-07100KL)
R66  Resistance: 10K  [SMD_RES_0402(1005)_N]  (hidden comment: RC0402FR-0710KL)
R67  Resistance: 470R  [SMD_RES_0402(1005)_N]  (hidden comment: RC0402FR-07470RL)
R68  Resistance: 10K  [SMD_RES_0402(1005)_N]  (hidden comment: RC0402FR-0710KL)
R69  Resistance: 100K  [SMD_RES_0402(1005)_N]  (hidden comment: RC0402FR-07100KL)
TP22  TestPoint  [Pad]  (no BOM)

### Ports
EN (in)

### Nets
24V: Q1.3(S) R65.2
GND: D16.1(ANODE) D20.K J16.2 Q2.2(E) R69.2
BO_EN: R68.2 R69.1 TP22.1 ; port EN
NetD16_2: D16.2(CATHODE) F9.1 Q1.2(D) R66.2
NetD20_A: D20.A R66.1
NetF9_2: F9.2 J16.1
NetQ1_1: Q1.1(G) R65.1 R67.2
NetQ2_1: Q2.1(B) R68.1
NetQ2_3: Q2.3(C) R67.1

### Channels
BO1: designators end in _1; ports EN=BO_EN
BO2: designators end in _2; ports EN=BO_EN
BO3: designators end in _3; ports EN=BO_EN
BO4: designators end in _4; ports EN=BO_EN
BO5: designators end in _5; ports EN=BO_EN
BO6: designators end in _6; ports EN=BO_EN
BO7: designators end in _7; ports EN=BO_EN
BO8: designators end in _8; ports EN=BO_EN

### Notes on the sheet
- (near F9) 500mA limit
- FILE NAME
- PROJECT
- TITLE
- REV
- AUTHOR
- SIZE
- SHEET
- DATE
- OF
- A3
- (in symbol LEDS1-4-26) 6.4mm

### Library data of the parts
D16 = SMF22A: as D1 on sheet OpenPLCv0.2.0_AnalogueOutput
D20 = TJ-L3FYTGCTCGSFLC2G-A5: as D23 on sheet OpenPLCv0.2.0_IOLED
F9 = JK-NSMD025-30V: Polymeric 30V 500mA 0.08s 700mΩ 1206 PTC Resettable Fuses RoHS
J16 = WJ2EDGRC-5.08-2P: as J3 on sheet OpenPLCv0.2.0_AnalogueOutput
J21 = LEDS1-4-26: 3mm LED spacer 6.4mm height
Q1 = SE20P03: P-Channel 30V 19A 3V @ 250uA 50mΩ @ 10A,10V 30W TO-252-2(DPAK) MOSFET RoHS
Q2 = PMBT3904,215: as Q10 on sheet OpenPLCv0.2.0_TopLevel
R65 R69 = 100K 0402 1% 1/16W: 100kΩ ±1% 1/16W ±100ppm/℃ 0402 Chip Resistor - Surface Mount RoHS; Package: 0402; Tolerance: 1%; Power Rating: 1/16W
R66 R68 = 10K 0402 1% 1/16W: as R79 on sheet OpenPLCv0.2.0_TopLevel; Package: 0402; Tolerance: 1%; Power Rating: 1/16W
R67 = 470R 0402 1% 1W: as R43 on sheet OpenPLCv0.2.0_ComputeModule; Package: 0402; Tolerance: 1%
TP22 = Test point

## Sheet OpenPLCv0.2.0_Buzzer.SchDoc
size 420 x 297 mm; PageSetup: Record=PageOptions|CenterHorizontal=True|CenterVertical=True|PrintScale=1.01|XCorrection=1.00|YCorrection=1.00|PrintKind=1|BorderSize=5000000|LeftOffset=0|BottomOffset=0|Orientation=2|PaperLength=1000|PaperWidth=1000|Scale=100|PaperSource=7|PrintQuality=-4|MediaType=1|DitherType=10|PaperKind=A3|PrintScaleMode=1; DocumentNumber: 18; SheetNumber: 18; SheetTotal: 22; SheetTitle: Buzzer
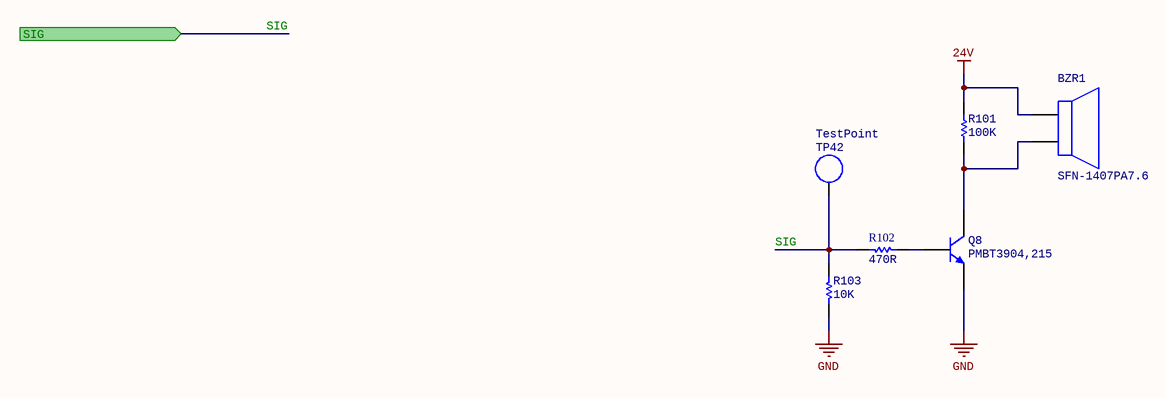
[diagram p6: OpenPLCv0.2.0_Buzzer.SchDoc]

### Parts
BZR1  SFN-1407PA7.6  [SFN-1407PA7.6]
Q8  PMBT3904,215  [SOT23-3]
R101  Resistance: 100K  [SMD_RES_0402(1005)_N]  (hidden comment: RC0402FR-07100KL)
R102  Resistance: 470R  [SMD_RES_0402(1005)_N]  (hidden comment: RC0402FR-07470RL)
R103  Resistance: 10K  [SMD_RES_0402(1005)_N]  (hidden comment: RC0402FR-0710KL)
TP42  TestPoint  [Pad]  (no BOM)

### Ports
SIG (in)

### Nets
24V: BZR1.1 R101.2
GND: Q8.2(E) R103.1
SIG: R102.1 R103.2 TP42.1 ; port SIG  [project net PWM9]
NetBZR1_2: BZR1.2 Q8.3(C) R101.1
NetQ8_1: Q8.1(B) R102.2

### Notes on the sheet
- FILE NAME
- PROJECT
- TITLE
- REV
- AUTHOR
- SIZE
- SHEET
- DATE
- OF
- A3

### Library data of the parts
BZR1 = SFN-1407PA7.6: Piezo YES 3300±500Hz 85dB @ 24V, 10cm 24V Φ23.5mm Through Hole Buzzers RoHS
Q8 = PMBT3904,215: as Q10 on sheet OpenPLCv0.2.0_TopLevel
R101 = 100K 0402 1% 1/16W: as R65 on sheet OpenPLCv0.2.0_BinaryOut; Package: 0402; Tolerance: 1%; Power Rating: 1/16W
R102 = 470R 0402 1% 1W: as R43 on sheet OpenPLCv0.2.0_ComputeModule; Package: 0402; Tolerance: 1%
R103 = 10K 0402 1% 1/16W: as R79 on sheet OpenPLCv0.2.0_TopLevel; Package: 0402; Tolerance: 1%; Power Rating: 1/16W
TP42 = Test point

## Sheet OpenPLCv0.2.0_ExpansionHeader.SchDoc
size 420 x 297 mm; PageSetup: Record=PageOptions|CenterHorizontal=True|CenterVertical=True|PrintScale=1.01|XCorrection=1.00|YCorrection=1.00|PrintKind=1|BorderSize=5000000|LeftOffset=0|BottomOffset=0|Orientation=2|PaperLength=1000|PaperWidth=1000|Scale=100|PaperSource=7|PrintQuality=-4|MediaType=1|DitherType=10|PaperKind=A3|PrintScaleMode=1; DocumentNumber: 19; SheetNumber: 19; SheetTotal: 22; SheetTitle: Expansion Headers
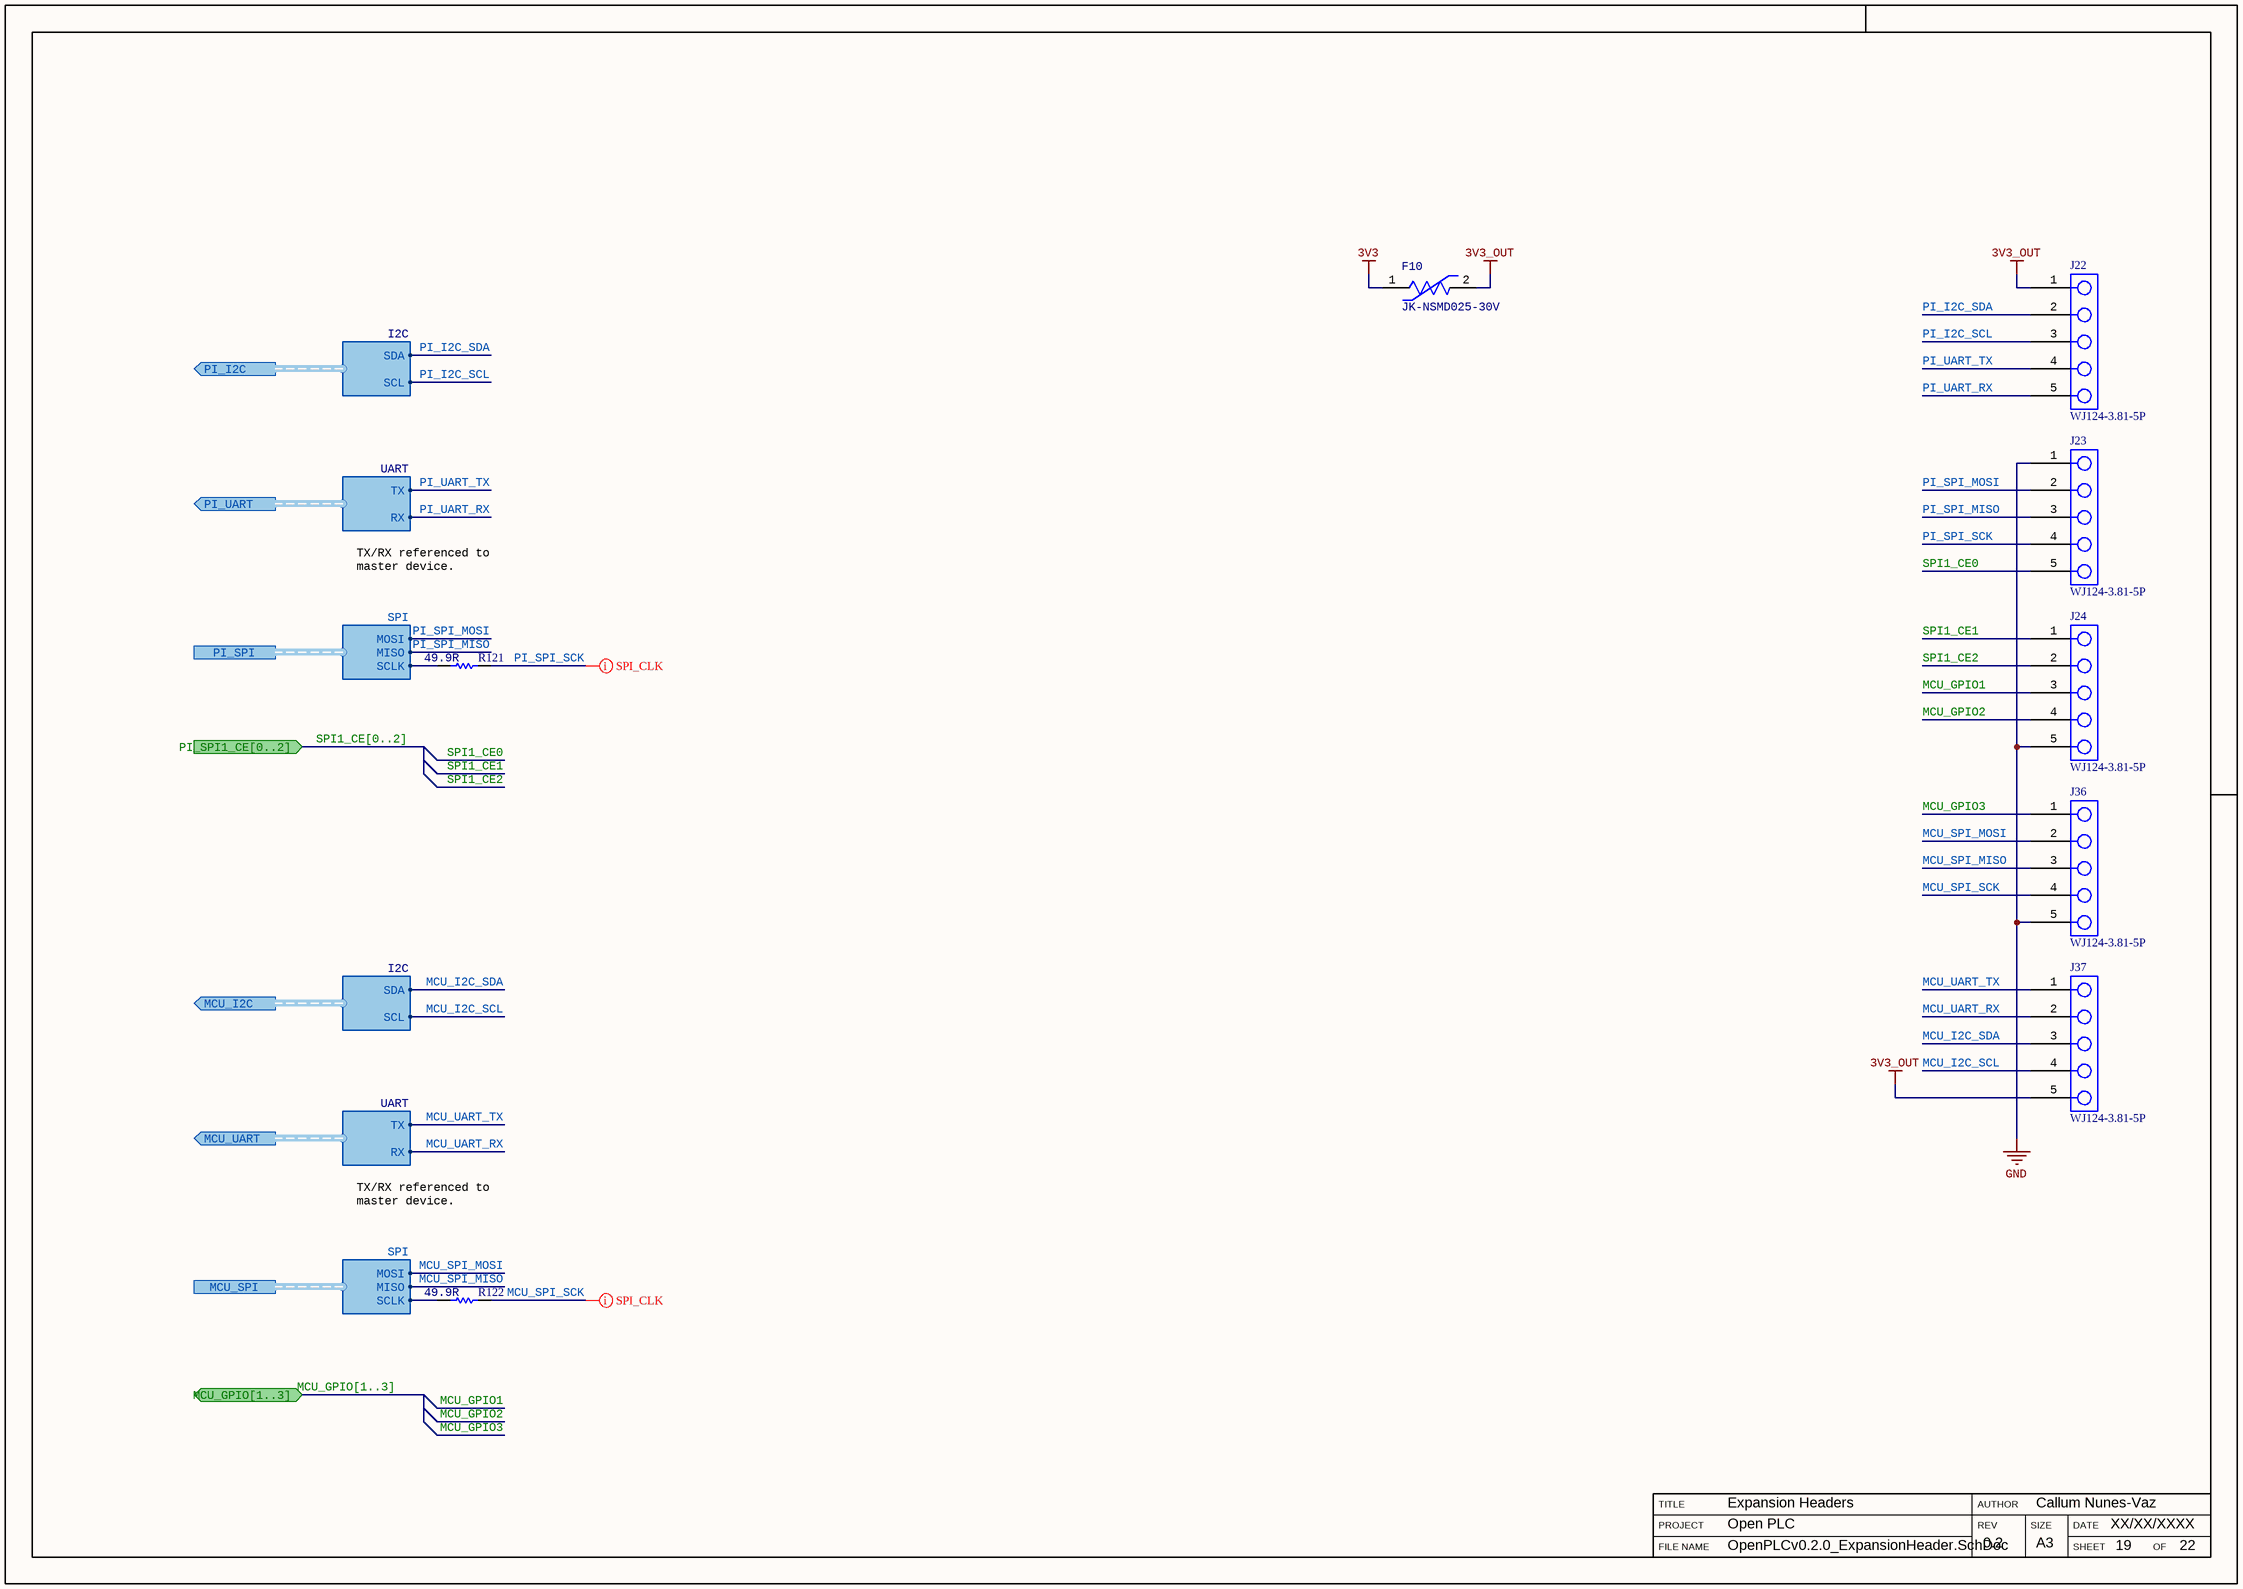
[diagram p7: OpenPLCv0.2.0_ExpansionHeader.SchDoc]

### Parts
F10  JK-NSMD025-30V  [SMD_RES_1206(3216)_N]
J22  WJ124-3.81-5P  [WJ124-3.81-5P_BoardEdgeAlt]
J23  WJ124-3.81-5P  [WJ124-3.81-5P_BoardEdgeAlt]
J24  WJ124-3.81-5P  [WJ124-3.81-5P_BoardEdgeAlt]
J36  WJ124-3.81-5P  [WJ124-3.81-5P_BoardEdgeAlt]
J37  WJ124-3.81-5P  [WJ124-3.81-5P_BoardEdgeAlt]
R121  Resistance: 49.9R  [SMD_RES_0402(1005)_N]  (hidden comment: RC0402FR-0749R9L)
R122  Resistance: 49.9R  [SMD_RES_0402(1005)_N]  (hidden comment: RC0402FR-0749R9L)

### Ports
MCU_GPIO[1..3] (bidir), MCU_I2C (out, harness I2C), MCU_SPI (harness SPI), MCU_UART (out, harness UART), PI_I2C (out, harness I2C), PI_SPI1_CE[0..2] (in), PI_SPI (harness SPI), PI_UART (out, harness UART)

### Harnesses
I2C: SDA, SCL
UART: TX, RX
SPI: MOSI, MISO, SCLK

### Nets
3V3: F10.1
3V3_OUT: F10.2 J22.1 J37.5
GND: J23.1 J24.5 J36.5
GPIO21: R121.1 ; port PI_SPI.SCLK
MCU_GPIO1: J24.3  [project net DIR_ALT]
MCU_GPIO2: J24.4  [project net EXP_GPIO7]
MCU_GPIO3: J36.1  [project net EXP_GPIO8]
MCU_I2C_SCL: J37.4 ; port MCU_I2C.SCL  [project net I2C.SCL]
MCU_I2C_SDA: J37.3 ; port MCU_I2C.SDA  [project net I2C.SDA]
MCU_SPI_MISO: J36.3 ; port MCU_SPI.MISO
MCU_SPI_MOSI: J36.2 ; port MCU_SPI.MOSI
MCU_SPI_SCK: J36.4 R122.2
MCU_UART_RX: J37.2 ; port MCU_UART.RX
MCU_UART_TX: J37.1 ; port MCU_UART.TX
PI_I2C_SCL: J22.3 ; port PI_I2C.SCL  [project net GPIO3]
PI_I2C_SDA: J22.2 ; port PI_I2C.SDA  [project net GPIO2]
PI_SPI_MISO: J23.3 ; port PI_SPI.MISO  [project net GPIO19]
PI_SPI_MOSI: J23.2 ; port PI_SPI.MOSI  [project net GPIO20]
PI_SPI_SCK: J23.4 R121.2
PI_UART_RX: J22.5 ; port PI_UART.RX  [project net GPIO13]
PI_UART_TX: J22.4 ; port PI_UART.TX  [project net GPIO12]
SPI1_CE0: J23.5  [project net GPIO18]
SPI1_CE1: J24.1  [project net GPIO17]
SPI1_CE2: J24.2  [project net GPIO16]
SPI2_SCK: R122.1 ; port MCU_SPI.SCLK

### Buses and harness runs
bus MCU_GPIO[1..3] = port MCU_GPIO[1..3]
bus SPI1_CE[0..2] = port PI_SPI1_CE[0..2]

### Layout directives
net class SPI_CLK: MCU_SPI_SCK, PI_SPI_SCK

### Notes on the sheet
- TX/RX referenced to master device.
- FILE NAME
- PROJECT
- TITLE
- REV
- AUTHOR
- SIZE
- SHEET
- DATE
- OF
- A3

### Library data of the parts
F10 = JK-NSMD025-30V: as F9 on sheet OpenPLCv0.2.0_BinaryOut
J22-J24 J36 J37 = WJ124-3.81-5P: 5 Wiring Board - Line to Board 0.150"(3.81mm) 5 1 P=3.81mm Screw terminal ROHS
R121 R122 = 49R9 0402 1% 1/16W: 49.9Ω ±1% 1/16W ±100ppm/℃ 0402 Chip Resistor - Surface Mount RoHS; Package: 0402; Tolerance: 1%; Power Rating: 1/16W